# EAGLE design sr_controller_v1_revB (EAGLE 6.3)
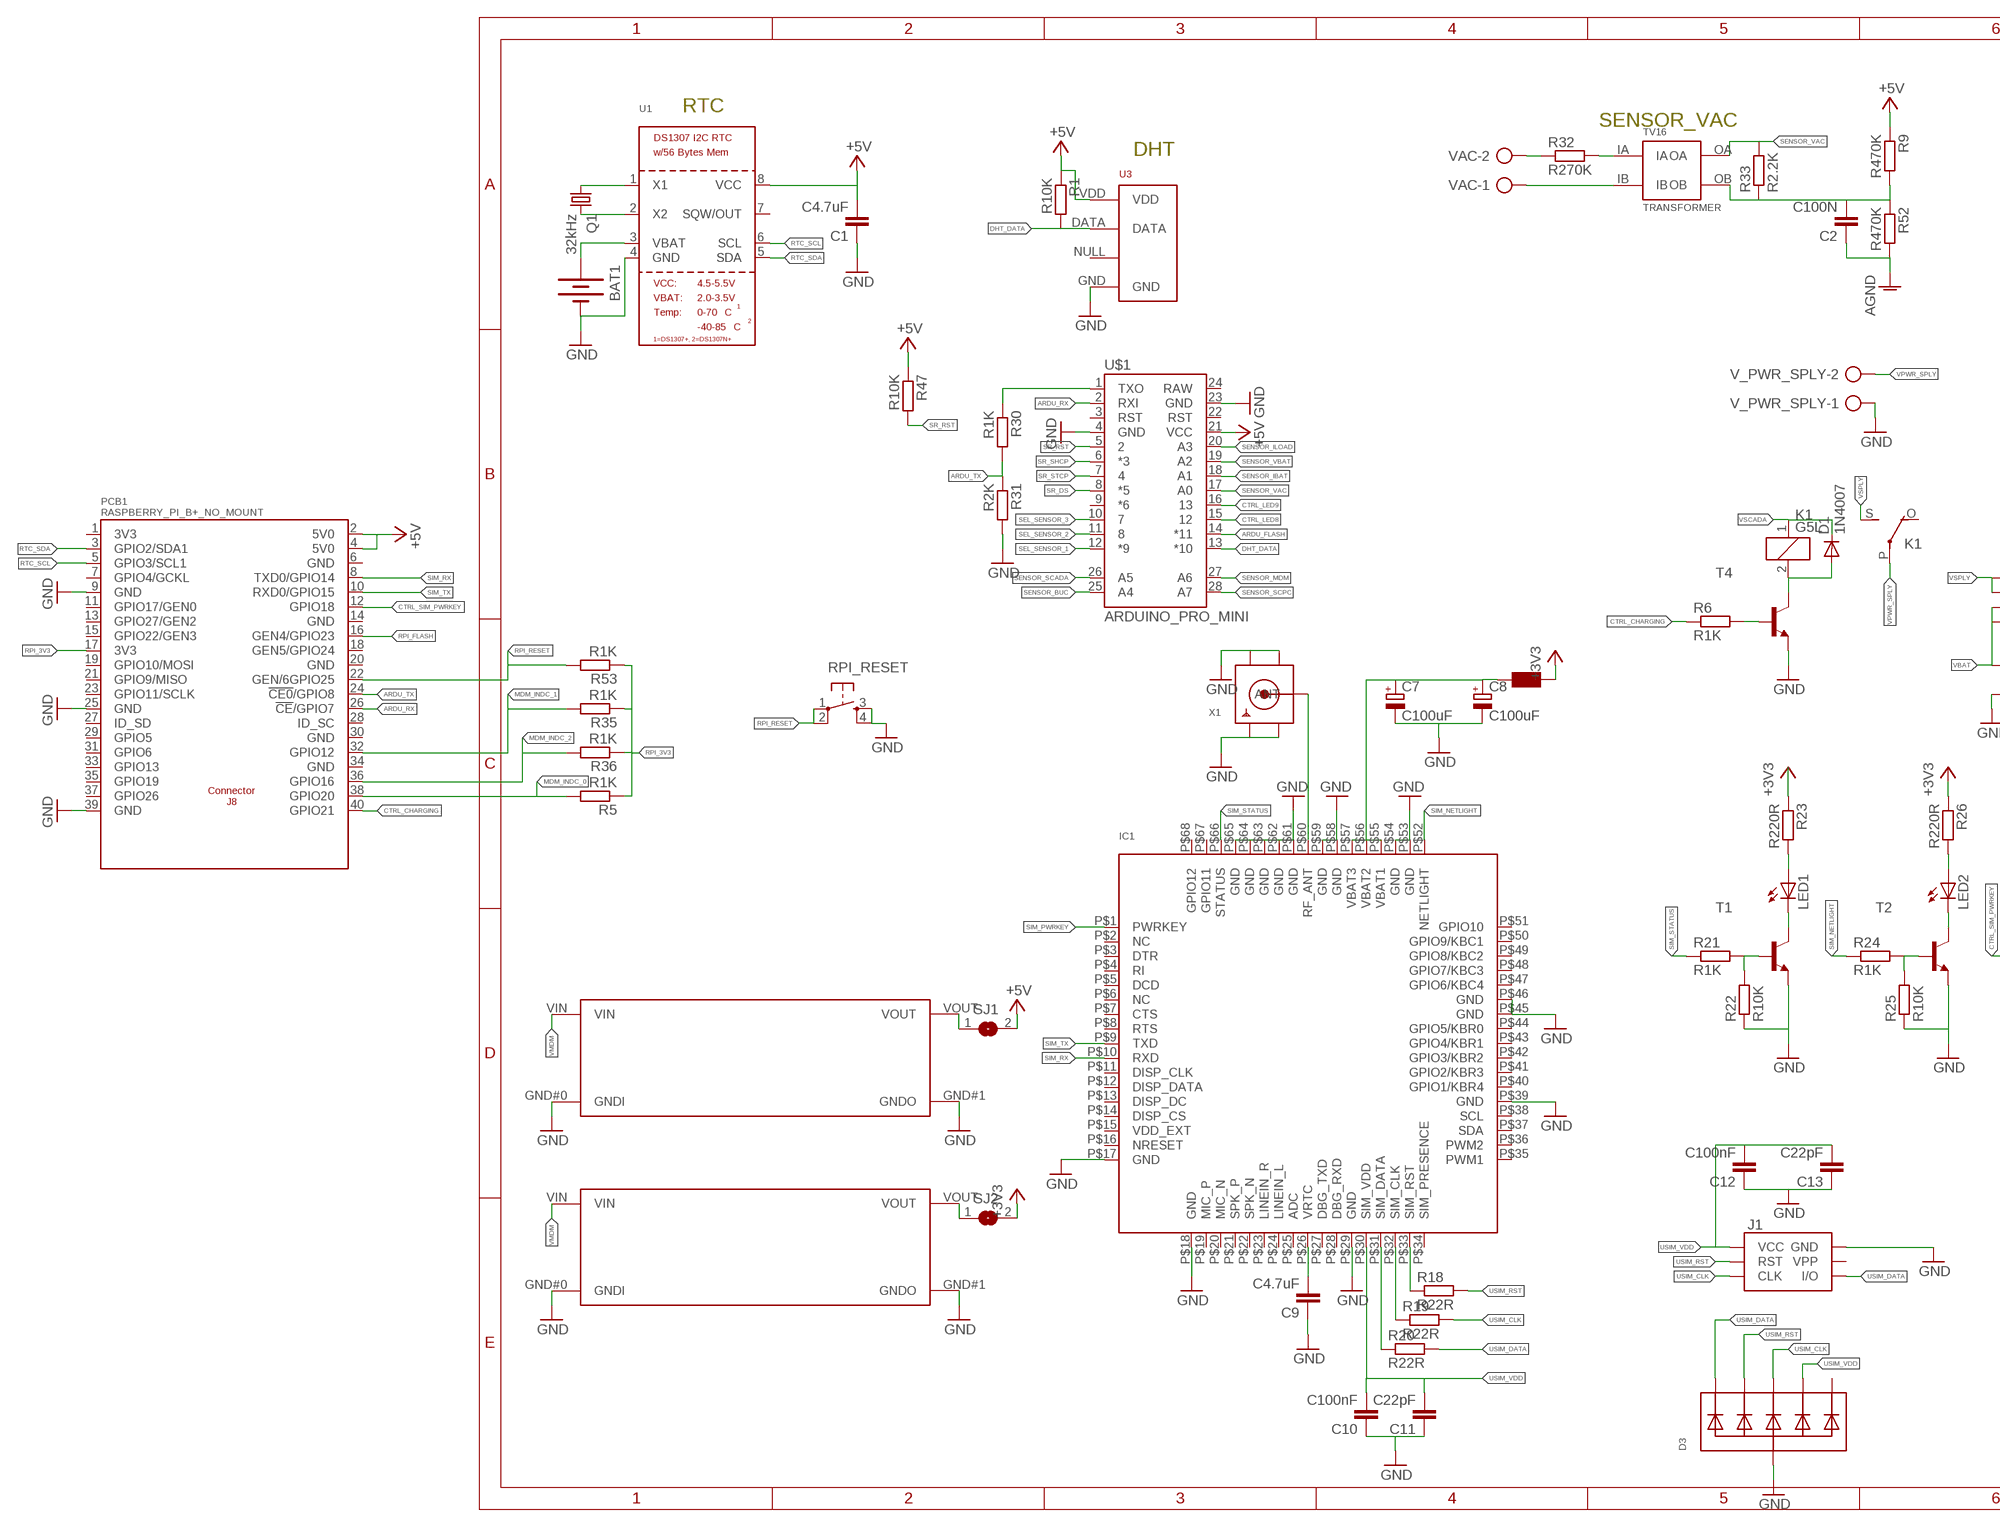
[diagram p0: schematic, sheet 1, part 1 of 2]
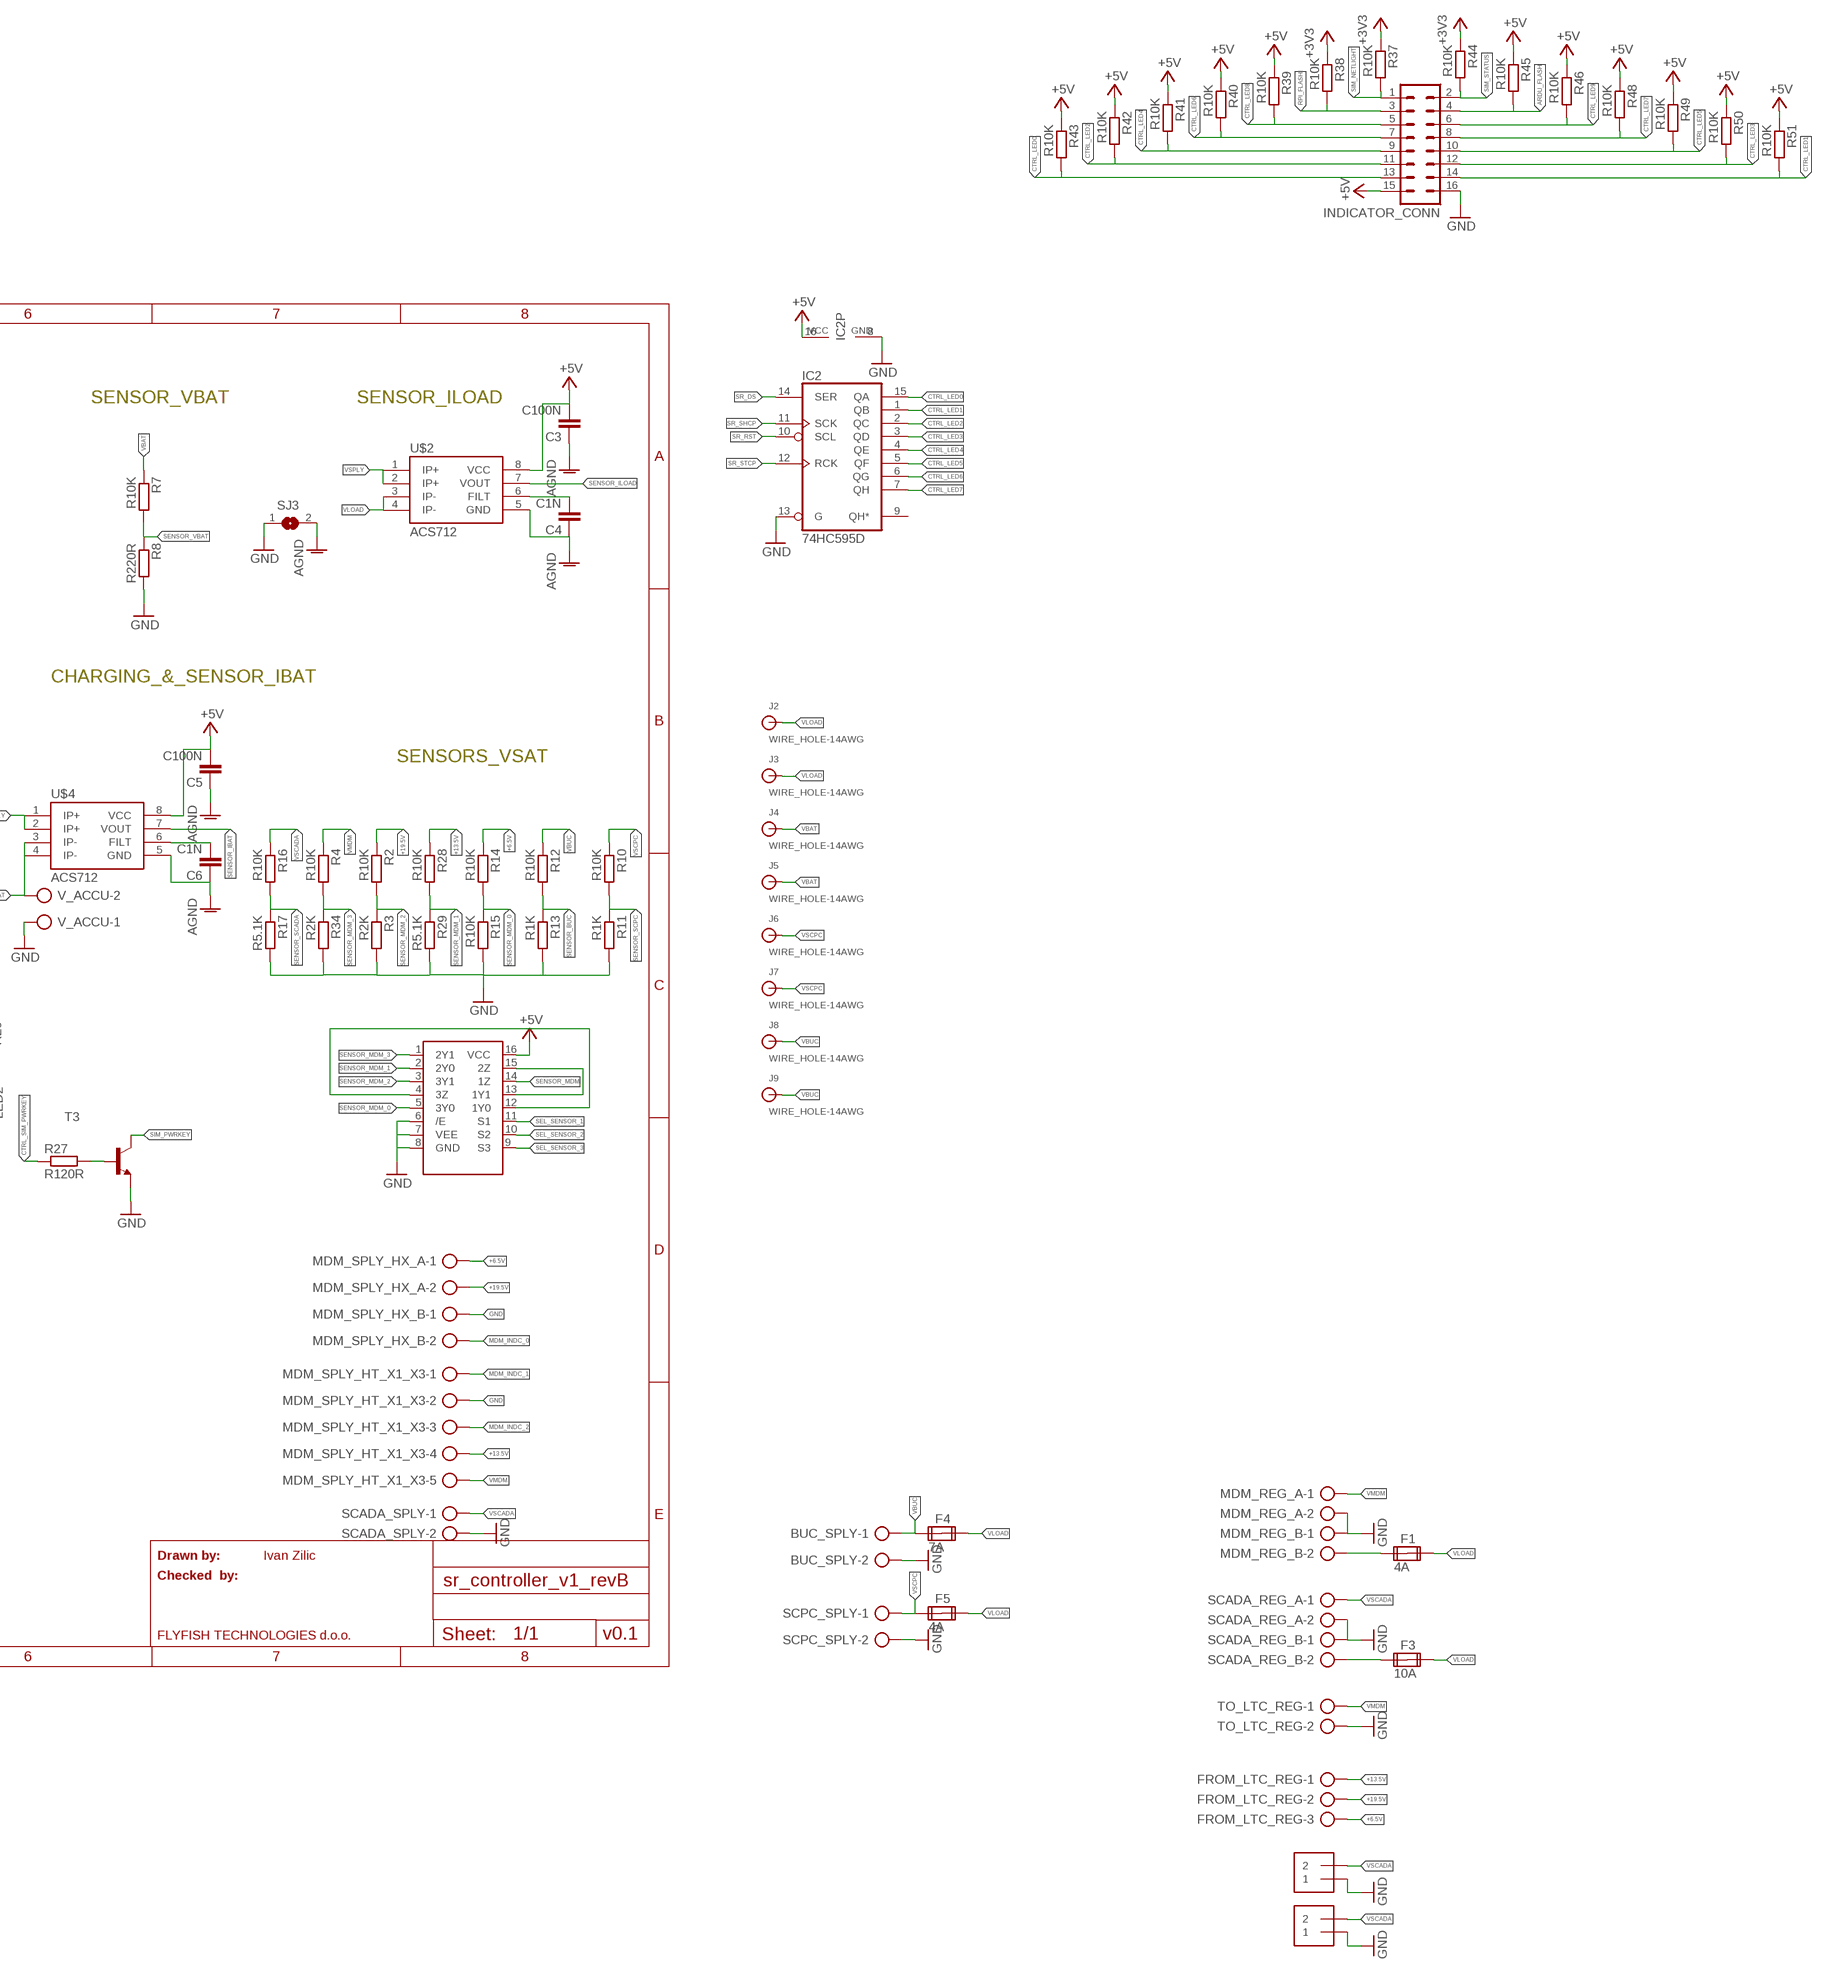
[diagram p1: schematic, sheet 1, part 2 of 2]

## Parts
BAT1  BATTERY20PTH  [BATTCOM_20MM_PTH]
BUC_SPLY  AK300/2  [AK300/2]
C1  C4.7uF  C-EUC0805  [C0805]
C2  C100N  C-EUC0805K  [C0805K]
C3  C100N  C-EUC0805K  [C0805K]
C4  C1N  C-EUC0805K  [C0805K]
C5  C100N  C-EUC0805K  [C0805K]
C6  C1N  C-EUC0805K  [C0805K]
C7  C100uF  CPOL-EU153CLV-0605  [153CLV-0605]
C8  C100uF  CPOL-EU153CLV-0605  [153CLV-0605]
C9  C4.7uF  C-EUC0805  [C0805]
C10  C100nF  C-EUC0805  [C0805]
C11  C22pF  C-EUC0805  [C0805]
C12  C100nF  C-EUC0805  [C0805]
C13  C22pF  C-EUC0805  [C0805]
D1  1N4007  DIODE-DO214AA  [DO214AA]
D3  TVSARRAY_5LANE  [SOT363]
F1  4A  FUSE2P  [FUSE1]
F3  10A  FUSE2P  [FUSE1]
F4  7A  FUSE2P  [FUSE1]
F5  4A  FUSE2P  [FUSE1]
FAN_A  1X2-3.5MM  [1X2-3.5MM]
FAN_B  1X2-3.5MM  [1X2-3.5MM]
FROM_LTC_REG  AK300/3  [AK300/3]
IC1  GSM_SIM900_LITERAL  [SIM900_SMT]
IC2  74HC595D  [SO16]
INDICATOR_CONN  MA08-2  [MA08-2]
J1  SIMHOLDERSIM  [SIMHOLDER]
J2  WIRE_HOLE-14AWG  [WIRE_HOLE-14AWG]
J3  WIRE_HOLE-14AWG  [WIRE_HOLE-14AWG]
J4  WIRE_HOLE-14AWG  [WIRE_HOLE-14AWG]
J5  WIRE_HOLE-14AWG  [WIRE_HOLE-14AWG]
J6  WIRE_HOLE-14AWG  [WIRE_HOLE-14AWG]
J7  WIRE_HOLE-14AWG  [WIRE_HOLE-14AWG]
J8  WIRE_HOLE-14AWG  [WIRE_HOLE-14AWG]
J9  WIRE_HOLE-14AWG  [WIRE_HOLE-14AWG]
K1  G5L  [G5LE]
L1  FB0603  L0603  [L0603]
LED1  LEDCHIPLED_0805  [CHIPLED_0805]
LED2  LEDCHIPLED_0805  [CHIPLED_0805]
MDM_REG_A  AK300/2  [AK300/2]
MDM_REG_B  AK300/2  [AK300/2]
MDM_SPLY_HT_X1_X3  AK300/5  [AK300/5]
MDM_SPLY_HX_A  AK500/2  [AK500/2]
MDM_SPLY_HX_B  AK500/2  [AK500/2]
PCB1  RASPBERRY_PI_B+_NO_MOUNT  [RASPBERRY_PI_B+]
Q1  32kHz  CRYSTALTC38H  [TC38H]
R1  R10K  R-EU_R0805  [R0805]
R2  R10K  R-EU_R0805  [R0805]
R3  R2K  R-EU_R0805  [R0805]
R4  R10K  R-EU_R0805  [R0805]
R5  R1K  R-EU_R0805  [R0805]
R6  R1K  R-EU_R0805  [R0805]
R7  R10K  R-EU_R0805  [R0805]
R8  R220R  R-EU_R0805  [R0805]
R9  R470K  R-EU_R0805  [R0805]
R10  R10K  R-EU_R0805  [R0805]
R11  R1K  R-EU_R0805  [R0805]
R12  R10K  R-EU_R0805  [R0805]
R13  R1K  R-EU_R0805  [R0805]
R14  R10K  R-EU_R0805  [R0805]
R15  R10K  R-EU_R0805  [R0805]
R16  R10K  R-EU_R0805  [R0805]
R17  R5.1K  R-EU_R0805  [R0805]
R18  R22R  R-EU_R0805  [R0805]
R19  R22R  R-EU_R0805  [R0805]
R20  R22R  R-EU_R0805  [R0805]
R21  R1K  R-EU_R0805  [R0805]
R22  R10K  R-EU_R0805  [R0805]
R23  R220R  R-EU_R0805  [R0805]
R24  R1K  R-EU_R0805  [R0805]
R25  R10K  R-EU_R0805  [R0805]
R26  R220R  R-EU_R0805  [R0805]
R27  R120R  R-EU_R0805  [R0805]
R28  R10K  R-EU_R0805  [R0805]
R29  R5.1K  R-EU_R0805  [R0805]
R30  R1K  R-EU_R0805  [R0805]
R31  R2K  R-EU_R0805  [R0805]
R32  R270K  R-EU_0309/10  [0309/10]
R33  R2.2K  R-EU_0309/10  [0309/10]
R34  R2K  R-EU_R0805  [R0805]
R35  R1K  R-EU_R0805  [R0805]
R36  R1K  R-EU_R0805  [R0805]
R37  R10K  R-EU_R0805  [R0805]
R38  R10K  R-EU_R0805  [R0805]
R39  R10K  R-EU_R0805  [R0805]
R40  R10K  R-EU_R0805  [R0805]
R41  R10K  R-EU_R0805  [R0805]
R42  R10K  R-EU_R0805  [R0805]
R43  R10K  R-EU_R0805  [R0805]
R44  R10K  R-EU_R0805  [R0805]
R45  R10K  R-EU_R0805  [R0805]
R46  R10K  R-EU_R0805  [R0805]
R47  R10K  R-EU_R0805  [R0805]
R48  R10K  R-EU_R0805  [R0805]
R49  R10K  R-EU_R0805  [R0805]
R50  R10K  R-EU_R0805  [R0805]
R51  R10K  R-EU_R0805  [R0805]
R52  R470K  R-EU_R0805  [R0805]
R53  R1K  R-EU_R0805  [R0805]
RPI_RESET  TAC_SWITCHPTH  [TACTILE-PTH]
SCADA_REG_A  AK300/2  [AK300/2]
SCADA_REG_B  AK300/2  [AK300/2]
SCADA_SPLY  AK500/2  [AK500/2]
SCPC_SPLY  AK300/2  [AK300/2]
SJ1  SOLDERJUMPER  [SOLDERJUMPER_ARROW_NOPASTE]
SJ2  SOLDERJUMPER  [SOLDERJUMPER_ARROW_NOPASTE]
SJ3  SOLDERJUMPERCLOSED  [SOLDERJUMPER_CLOSEDWIRE]
T1  MMBT2222ALT1-NPN-SOT23-BEC  [SOT23-BEC]
T2  MMBT2222ALT1-NPN-SOT23-BEC  [SOT23-BEC]
T3  MMBT2222ALT1-NPN-SOT23-BEC  [SOT23-BEC]
T4  MMBT2222ALT1-NPN-SOT23-BEC  [SOT23-BEC]
TO_LTC_REG  AK300/2  [AK300/2]
TV16  TRANSFORMER  [TV16]
U1  RTC_DS1307  [SOIC8_150MIL]
U3  RHT03_DHT-22_AM2302  [RHT03_DHT-22]
U$1  ARDUINO_PRO_MINI  [ARDUINO_PRO_MINI]
U$2  ACS712  [SO08]
U$3  DCDCMODULE  [DCDCMODULE]
U$4  ACS712  [SO08]
U$6  DCDCMODULE  [DCDCMODULE]
U$8  74HC4053D  [SO16]
V_ACCU  AK300/2  [AK300/2]
V_PWR_SPLY  AK300/2  [AK300/2]
VAC  AK300/2  [AK300/2]
X1  SMACONNECTOR  [SMA90_DIP]

## Nets
+3V3: L1.2 R23.1 R26.1 R37.1 R38.1 R44.1 SJ2.2
+5V: C1.2 C3.2 C5.2 IC2.16(VCC) INDICATOR_CONN.15 PCB1.2(5V0) PCB1.4(5V0) R1.1 R9.1 R39.1 R40.1 R41.1 R42.1 R43.1 R45.1 R46.1 R47.1 R48.1 R49.1 R50.1 R51.1 SJ1.2 U1.8(VCC) U3.VDD U$1.21(VCC) U$2.8(VCC) U$4.8(VCC) U$8.16(VCC)
+6.5V: FROM_LTC_REG.3 MDM_SPLY_HX_A.1 R14.1
+13.5V: FROM_LTC_REG.1 MDM_SPLY_HT_X1_X3.4 R28.1
+19.5V: FROM_LTC_REG.2 MDM_SPLY_HX_A.2 R2.1
AGND: C2.1 C3.1 C4.1 C5.1 C6.1 R52.2 SJ3.2 U$2.5(GND) U$4.5(GND)
ARDU_FLASH: INDICATOR_CONN.4 R45.2 U$1.14(*11)
ARDU_RX: PCB1.26(!CE!/GPIO7) U$1.2(RXI)
ARDU_TX: PCB1.24(!CE0!/GPIO8) R30.2 R31.1
CTRL_CHARGING: PCB1.40(GPIO21) R6.1
CTRL_LED0: IC2.15(QA) INDICATOR_CONN.13 R43.2
CTRL_LED1: IC2.1(QB) INDICATOR_CONN.14 R51.2
CTRL_LED2: IC2.2(QC) INDICATOR_CONN.11 R42.2
CTRL_LED3: IC2.3(QD) INDICATOR_CONN.12 R50.2
CTRL_LED4: IC2.4(QE) INDICATOR_CONN.9 R41.2
CTRL_LED5: IC2.5(QF) INDICATOR_CONN.10 R49.2
CTRL_LED6: IC2.6(QG) INDICATOR_CONN.7 R40.2
CTRL_LED7: IC2.7(QH) INDICATOR_CONN.8 R48.2
CTRL_LED8: INDICATOR_CONN.5 R39.2 U$1.15
CTRL_LED9: INDICATOR_CONN.6 R46.2 U$1.16
CTRL_SIM_PWRKEY: PCB1.12(GPIO18) R27.1
DHT_DATA: R1.2 U3.DATA U$1.13(*10)
GND: BAT1.2(-) BUC_SPLY.2 C1.1 C7.- C8.- C9.1 C10.1 C11.1 C12.1 C13.1 D3.2(A) FAN_A.1 FAN_B.1 IC1.P$17(GND) IC1.P$18(GND) IC1.P$29(GND) IC1.P$39(GND) IC1.P$45(GND) IC1.P$46(GND) IC1.P$53(GND) IC1.P$54(GND) IC1.P$58(GND) IC1.P$59(GND) IC1.P$61(GND) IC1.P$62(GND) IC1.P$63(GND) IC1.P$64(GND) IC1.P$65(GND) IC2.8(GND) IC2.13(G) INDICATOR_CONN.16 J1.C5(GND) MDM_REG_A.2 MDM_REG_B.1 MDM_SPLY_HT_X1_X3.2 MDM_SPLY_HX_B.1 PCB1.9(GND) PCB1.25(GND) PCB1.39(GND) R3.2 R8.2 R11.2 R13.2 R15.2 R17.2 R22.1 R25.1 R29.2 R31.2 R34.2 RPI_RESET.3 RPI_RESET.4 SCADA_REG_A.2 SCADA_REG_B.1 SCADA_SPLY.2 SCPC_SPLY.2 SJ3.1 T1.E T2.E T3.E T4.E TO_LTC_REG.2 U1.4(GND) U3.GND U$1.4(GND) U$1.23(GND) U$3.GND#0(GNDI) U$3.GND#1(GNDO) U$6.GND#0(GNDI) U$6.GND#1(GNDO) U$8.6(/E) U$8.7(VEE) U$8.8(GND) V_ACCU.1 V_PWR_SPLY.1 X1.GND1 X1.GND2 X1.GND3 X1.GND4
MDM_INDC_0: MDM_SPLY_HX_B.2 PCB1.38(GPIO20) R5.2
MDM_INDC_1: MDM_SPLY_HT_X1_X3.1 PCB1.32(GPIO12) R35.2
MDM_INDC_2: MDM_SPLY_HT_X1_X3.3 PCB1.36(GPIO16) R36.2
N$1: R32.1 VAC.2
N$2: TV16.IB VAC.1
N$3: Q1.1 U1.1(X1)
N$4: Q1.2 U1.2(X2)
N$5: BAT1.1(+) U1.3(VBAT)
N$6: U$8.13(1Y1) U$8.15(2Z)
N$7: U$8.4(3Z) U$8.12(1Y0)
N$8: SJ1.1 U$3.VOUT
N$9: SJ2.1 U$6.VOUT
N$10: C4.2 U$2.6(FILT)
N$13: R6.2 T4.B
N$16: C6.2 U$4.6(FILT)
N$17: F1.1A MDM_REG_B.2
N$19: F3.1A SCADA_REG_B.2
N$21: IC1.P$60(RF_ANT) X1.ANTENNA(ANT)
N$22: C7.+ C8.+ IC1.P$55(VBAT1) IC1.P$56(VBAT2) IC1.P$57(VBAT3) L1.1
N$23: C9.2 IC1.P$26(VRTC)
N$24: IC1.P$33(SIM_RST) R18.1
N$25: IC1.P$32(SIM_CLK) R19.1
N$26: IC1.P$31(SIM_DATA) R20.1
N$27: LED1.C T1.C
N$28: LED1.A R23.2
N$29: LED2.C T2.C
N$30: R21.2 R22.2 T1.B
N$31: LED2.A R26.2
N$32: R24.2 R25.2 T2.B
N$33: R27.2 T3.B
N$34: D1.A K1.2 T4.C
N$35: R30.1 U$1.1(TXO)
N$36: R32.2 TV16.IA
N$38: C2.2 R9.2 R33.1 R52.1 TV16.OB
RPI_3V3: PCB1.17(3V3) R5.1 R35.1 R36.1 R53.1
RPI_FLASH: INDICATOR_CONN.3 PCB1.16(GEN4/GPIO23) R38.2
RPI_RESET: PCB1.22(GEN/6GPIO25) R53.2 RPI_RESET.1 RPI_RESET.2
RTC_SCL: PCB1.5(GPIO3/SCL1) U1.6(SCL)
RTC_SDA: PCB1.3(GPIO2/SDA1) U1.5(SDA)
SEL_SENSOR_1: U$1.12(*9) U$8.11(S1)
SEL_SENSOR_2: U$1.11 U$8.10(S2)
SEL_SENSOR_3: U$1.10 U$8.9(S3)
SENSOR_BUC: R12.2 R13.1 U$1.25(A4)
SENSOR_IBAT: U$1.18(A1) U$4.7(VOUT)
SENSOR_ILOAD: U$1.20(A3) U$2.7(VOUT)
SENSOR_MDM: U$1.27(A6) U$8.14(1Z)
SENSOR_MDM_0: R14.2 R15.1 U$8.5(3Y0)
SENSOR_MDM_1: R28.2 R29.1 U$8.2(2Y0)
SENSOR_MDM_2: R2.2 R3.1 U$8.3(3Y1)
SENSOR_MDM_3: R4.2 R34.1 U$8.1(2Y1)
SENSOR_SCADA: R16.2 R17.1 U$1.26(A5)
SENSOR_SCPC: R10.2 R11.1 U$1.28(A7)
SENSOR_VAC: R33.2 TV16.OA U$1.17(A0)
SENSOR_VBAT: R7.2 R8.1 U$1.19(A2)
SIM_NETLIGHT: IC1.P$52(NETLIGHT) INDICATOR_CONN.1 R24.1 R37.2
SIM_PWRKEY: IC1.P$1(PWRKEY) T3.C
SIM_RX: IC1.P$10(RXD) PCB1.8(TXD0/GPIO14)
SIM_STATUS: IC1.P$66(STATUS) INDICATOR_CONN.2 R21.1 R44.2
SIM_TX: IC1.P$9(TXD) PCB1.10(RXD0/GPIO15)
SR_DS: IC2.14(SER) U$1.8(*5)
SR_RST: IC2.10(SCL) R47.2 U$1.5
SR_SHCP: IC2.11(SCK) U$1.6(*3)
SR_STCP: IC2.12(RCK) U$1.7
USIM_CLK: D3.4(C3) J1.C3(CLK) R19.2
USIM_DATA: D3.1(C1) J1.C7(I/O) R20.2
USIM_RST: D3.3(C2) J1.C2(RST) R18.2
USIM_VDD: C10.2 C11.2 C12.2 C13.2 D3.5(C4) IC1.P$30(SIM_VDD) J1.C1(VCC)
VBAT: J4.P$1 J5.P$1 R7.1 U$4.3(IP-) U$4.4(IP-) V_ACCU.2
VBUC: BUC_SPLY.1 F4.1A J8.P$1 J9.P$1 R12.1
VLOAD: F1.2A F3.2A F4.2A F5.2A J2.P$1 J3.P$1 U$2.3(IP-) U$2.4(IP-)
VMDM: MDM_REG_A.1 MDM_SPLY_HT_X1_X3.5 R4.1 TO_LTC_REG.1 U$3.VIN U$6.VIN
VPWR_SPLY: K1.P(2:P) V_PWR_SPLY.2
VSCADA: D1.C FAN_A.2 FAN_B.2 K1.1 R16.1 SCADA_REG_A.1 SCADA_SPLY.1
VSCPC: F5.1A J6.P$1 J7.P$1 R10.1 SCPC_SPLY.1
VSPLY: K1.S(2:S) U$2.1(IP+) U$2.2(IP+) U$4.1(IP+) U$4.2(IP+)
Unconnected: D3.6(C5) F1.1B F1.2B F3.1B F3.2B F4.1B F4.2B F5.1B F5.2B IC1.P$2(NC) IC1.P$3(DTR) IC1.P$4(RI) IC1.P$5(DCD) IC1.P$6(NC) IC1.P$7(CTS) IC1.P$8(RTS) IC1.P$11(DISP_CLK) IC1.P$12(DISP_DATA) IC1.P$13(DISP_DC) IC1.P$14(DISP_CS) IC1.P$15(VDD_EXT) IC1.P$16(NRESET) IC1.P$19(MIC_P) IC1.P$20(MIC_N) IC1.P$21(SPK_P) IC1.P$22(SPK_N) IC1.P$23(LINEIN_R) IC1.P$24(LINEIN_L) IC1.P$25(ADC) IC1.P$27(DBG_TXD) IC1.P$28(DBG_RXD) IC1.P$34(SIM_PRESENCE) IC1.P$35(PWM1) IC1.P$36(PWM2) IC1.P$37(SDA) IC1.P$38(SCL) IC1.P$40(GPIO1/KBR4) IC1.P$41(GPIO2/KBR3) IC1.P$42(GPIO3/KBR2) IC1.P$43(GPIO4/KBR1) IC1.P$44(GPIO5/KBR0) IC1.P$47(GPIO6/KBC4) IC1.P$48(GPIO7/KBC3) IC1.P$49(GPIO8/KBC2) IC1.P$50(GPIO9/KBC1) IC1.P$51(GPIO10) IC2.9(QH*) J1.C6(VPP) K1.O(2:O) PCB1.1(3V3) PCB1.6(GND) PCB1.7(GPIO4/GCKL) PCB1.11(GPIO17/GEN0) PCB1.13(GPIO27/GEN2) PCB1.14(GND) PCB1.15(GPIO22/GEN3) PCB1.18(GEN5/GPIO24) PCB1.19(GPIO10/MOSI) PCB1.20(GND) PCB1.21(GPIO9/MISO) PCB1.23(GPIO11/SCLK) PCB1.27(ID_SD) PCB1.28(ID_SC) PCB1.29(GPIO5) PCB1.30(GND) PCB1.31(GPIO6) PCB1.33(GPIO13) PCB1.34(GND) PCB1.35(GPIO19) PCB1.37(GPIO26) U1.7(SQW/OUT) U3.NULL U$1.3(RST) U$1.9(*6) U$1.22(RST) U$1.24(RAW)

## Notes on the sheet
- RTC
- SENSOR_VAC | SENSOR_VBAT | SENSOR_ILOAD
- DHT
- CHARGING_&_SENSOR_IBAT
- SENSORS_VSAT
- Drawn by: | Ivan Zilic
- Checked  by:
- FLYFISH TECHNOLOGIES d.o.o. | v0.1

## Power pins joined to a net without a drawn wire
GPIO11: IC1.P$67(GPIO11)
GPIO12: IC1.P$68(GPIO12)

## Library data of the parts
BAT1 = SparkFun-Electromechanical:BATTERY: Battery Holders Various common sizes : AA, AAA, 20mm coin cell and 12mm coin cell. 20MM_4LEGS, BATT-10373
BUC_SPLY MDM_REG_A MDM_REG_B SCADA_REG_A SCADA_REG_B SCPC_SPLY TO_LTC_REG V_ACCU V_PWR_SPLY VAC = con-ptr500:AK300/2: CONNECTOR; OC_FARNELL: unknown; OC_NEWARK: unknown
C1-C6 C9-C13 = resistor:C-EU: CAPACITOR, European symbol
C7 C8 = resistor:CPOL-EU: POLARIZED CAPACITOR, European symbol
D1 = diode:DIODE-: DIODE
D3 = microbuilder:TVSARRAY_5LANE: Voltage Transient Suppressor Array SOT363 SMF05C - 100W 5V: Digikey - SMF05CT1GOSCT-ND
F1 F3-F5 = special:FUSE2P: FUSE 5 x 20 mm
FAN_A FAN_B = adafruit:1X2: 3.5mm Terminal block http://www.ladyada.net/library/pcb/eaglelibrary.html
FROM_LTC_REG = con-ptr500:AK300/3: CONNECTOR; OC_FARNELL: unknown; OC_NEWARK: unknown
IC1 = microbuilder:GSM_SIM900_LITERAL: SIM900 Quad-Band GSM/GPRS Module Power Supply: 3.2-4.8V Temperature Range: -30�C-+80�C Bands: GSM 850, EGSM 900, DCS 1800, PCS 1900
IC2 = 74xx-eu:74*595: 8-bit SHIFT REGISTER, output latch
INDICATOR_CONN = con-lstb:MA08-2: PIN HEADER; OC_FARNELL: unknown; OC_NEWARK: unknown
J1 = SparkFun-Connectors:SIMHOLDER: SIM Socket Socket for SIM cellular cards. Schematic element and footprint production proven. Spark Fun Electronics SKU : PRT-00548; PROD_ID: CONN-08536
J2-J9 = powercube:WIRE_HOLE-14AWG: Solder point for 14AWG wire
K1 = relay:G5L: RELAY 1 x switch, 10 A/120 V AC, 8 A/30 V ADC, Omron; OC_FARNELL: unknown; OC_NEWARK: unknown
L1 = tigorcustom:L0603
LED1 LED2 = adafruit:LED: LED OSRAM: - CHIPLED LG R971, LG N971, LY N971, LG Q971, LY Q971, LO R971, LY R971 LH N974, LH R974 LS Q976, LO Q976, LY Q976 LO Q996 - Hyper CHIPLED LW Q18S LB Q993, LB Q99A, LB R99A - SideLED LS A670, LO A670, LY A670, LG A670, LP A670 LB A673, LV A673, LT A673, LW A673 LH A674 LY A675 LS A676, LA A676, LO A676, LY A676, LW A676 LS A679, LY A679, LG A679 - Hyper Micro SIDELED® LS Y876, LA Y876, LO Y876, LY Y876 LT Y87S - SmartLED LW L88C, LW L88S LB L89C, LB L89S, LG L890 LS L89K, LO L89K, LY L89K LS L896, LA L896, LO L896, LY L896 - TOPLED LS T670, LO T670, LY T670, LG T670, LP T670 LSG T670, LSP T670, LSY T670, LOP T670, LYG T670 LG T671, LOG T671, LSG T671 LB T673, LV T673, LT T673, LW T673 LH T674 LS T676, LA T676, LO T676, LY T676, LB T676, LH T676, LSB T676, LW T676 LB T67C, LV T67C, LT T67C, LS T67K, LO T67K, LY T67K, LW E67C LS E67B, LA E67B, LO E67B, LY E67B, LB E67C, LV E67C, LT E67C LW T67C LS T679, LY T679, LG T679 LS T770, LO T770, LY T770, LG T770, LP T770 LB T773, LV T773, LT T773, LW T773 LH T774 LS E675, LA E675, LY E675, LS T675 LS T776, LA T776, LO T776, LY T776, LB T776 LHGB T686 LT T68C, LB T68C - Hyper Mini TOPLED® LB M676 - Mini TOPLED Santana® LG M470 LS M47K, LO M47K, LY M47K Source: http://www.osram.convergy.de/
MDM_SPLY_HT_X1_X3 = con-ptr500:AK300/5: CONNECTOR; OC_FARNELL: unknown; OC_NEWARK: unknown
MDM_SPLY_HX_A MDM_SPLY_HX_B SCADA_SPLY = con-ptr500:AK500/2: CONNECTOR; OC_FARNELL: unknown; OC_NEWARK: unknown
PCB1 = tigorcustom:RASPBERRY_PI_B+_NO_MOUNT: Raspberry Pi B+ Based on issue: Thursday, July 10, 2014 - Rev 1.2 LBR by Tim R. 07-2014
Q1 = crystal:CRYSTAL: CRYSTAL; OC_FARNELL: unknown; OC_NEWARK: unknown
R1-R53 = resistor:R-EU_: RESISTOR, European symbol
RPI_RESET = SparkFun-Electromechanical:TAC_SWITCH: Momentary Switch Button commonly used for reset or general input. Spark Fun Electronics SKU : COM-00097 SMT- SWCH-08247
SJ1 SJ2 = microbuilder:SOLDERJUMPER: SMD Solder JUMPER Solder the two pads together to create a connection, or remove the solder to break it. REFLOW - Use this footprint for solder paste and reflow ovens. WAVE - Use this footprint for hand-soldering (larger pads). CLOSED - Has a trace between the two pads to ensure it is closed by default. The trace needs to be cut to disable the jumper, and can be closed again by creating a solder bridge between the two pads.; BOM: EXCLUDE
SJ3 = microbuilder:SOLDERJUMPER: SMD Solder JUMPER Solder the two pads together to create a connection, or remove the solder to break it. REFLOW - Use this footprint for solder paste and reflow ovens. WAVE - Use this footprint for hand-soldering (larger pads). CLOSED - Has a trace between the two pads to ensure it is closed by default. The trace needs to be cut to disable the jumper, and can be closed again by creating a solder bridge between the two pads.
T1-T4 = transistor:*-NPN-: NPN Transistror BF959 corrected 2008.03.06
TV16 = bontor:TRANSFORMER
U1 = microbuilder:RTC_DS1307: DS1307 I2C RTC with 56-Bytes RAM
U3 = RHT03_DHT-22_AM2302:RHT03_DHT-22_AM2302: RHT03 / DHT-22 / AM2302 Packages and symbol for the RHT03 / DHT-22 relative humidity and temperature sensor. Note: The AM2302 is a wired version of the DHT-22 which typically requires less clearance and is thus provided as a separate package.; PROD_ID: SEN-10167
U$1 = tigorcustom:ARDUINO_PRO_MINI
U$2 U$4 = SparkFun-AnalogIC:ACS712: Hall-effect-based isolated linear current sensor
U$3 U$6 = bontor:DCDCMODULE
U$8 = tigorcustom:74HC4053D
X1 = microbuilder:SMACONNECTOR: SMA Connector 90� DIP SMA Connector, 50 Ohm (4UConnector: 07259)

## Board
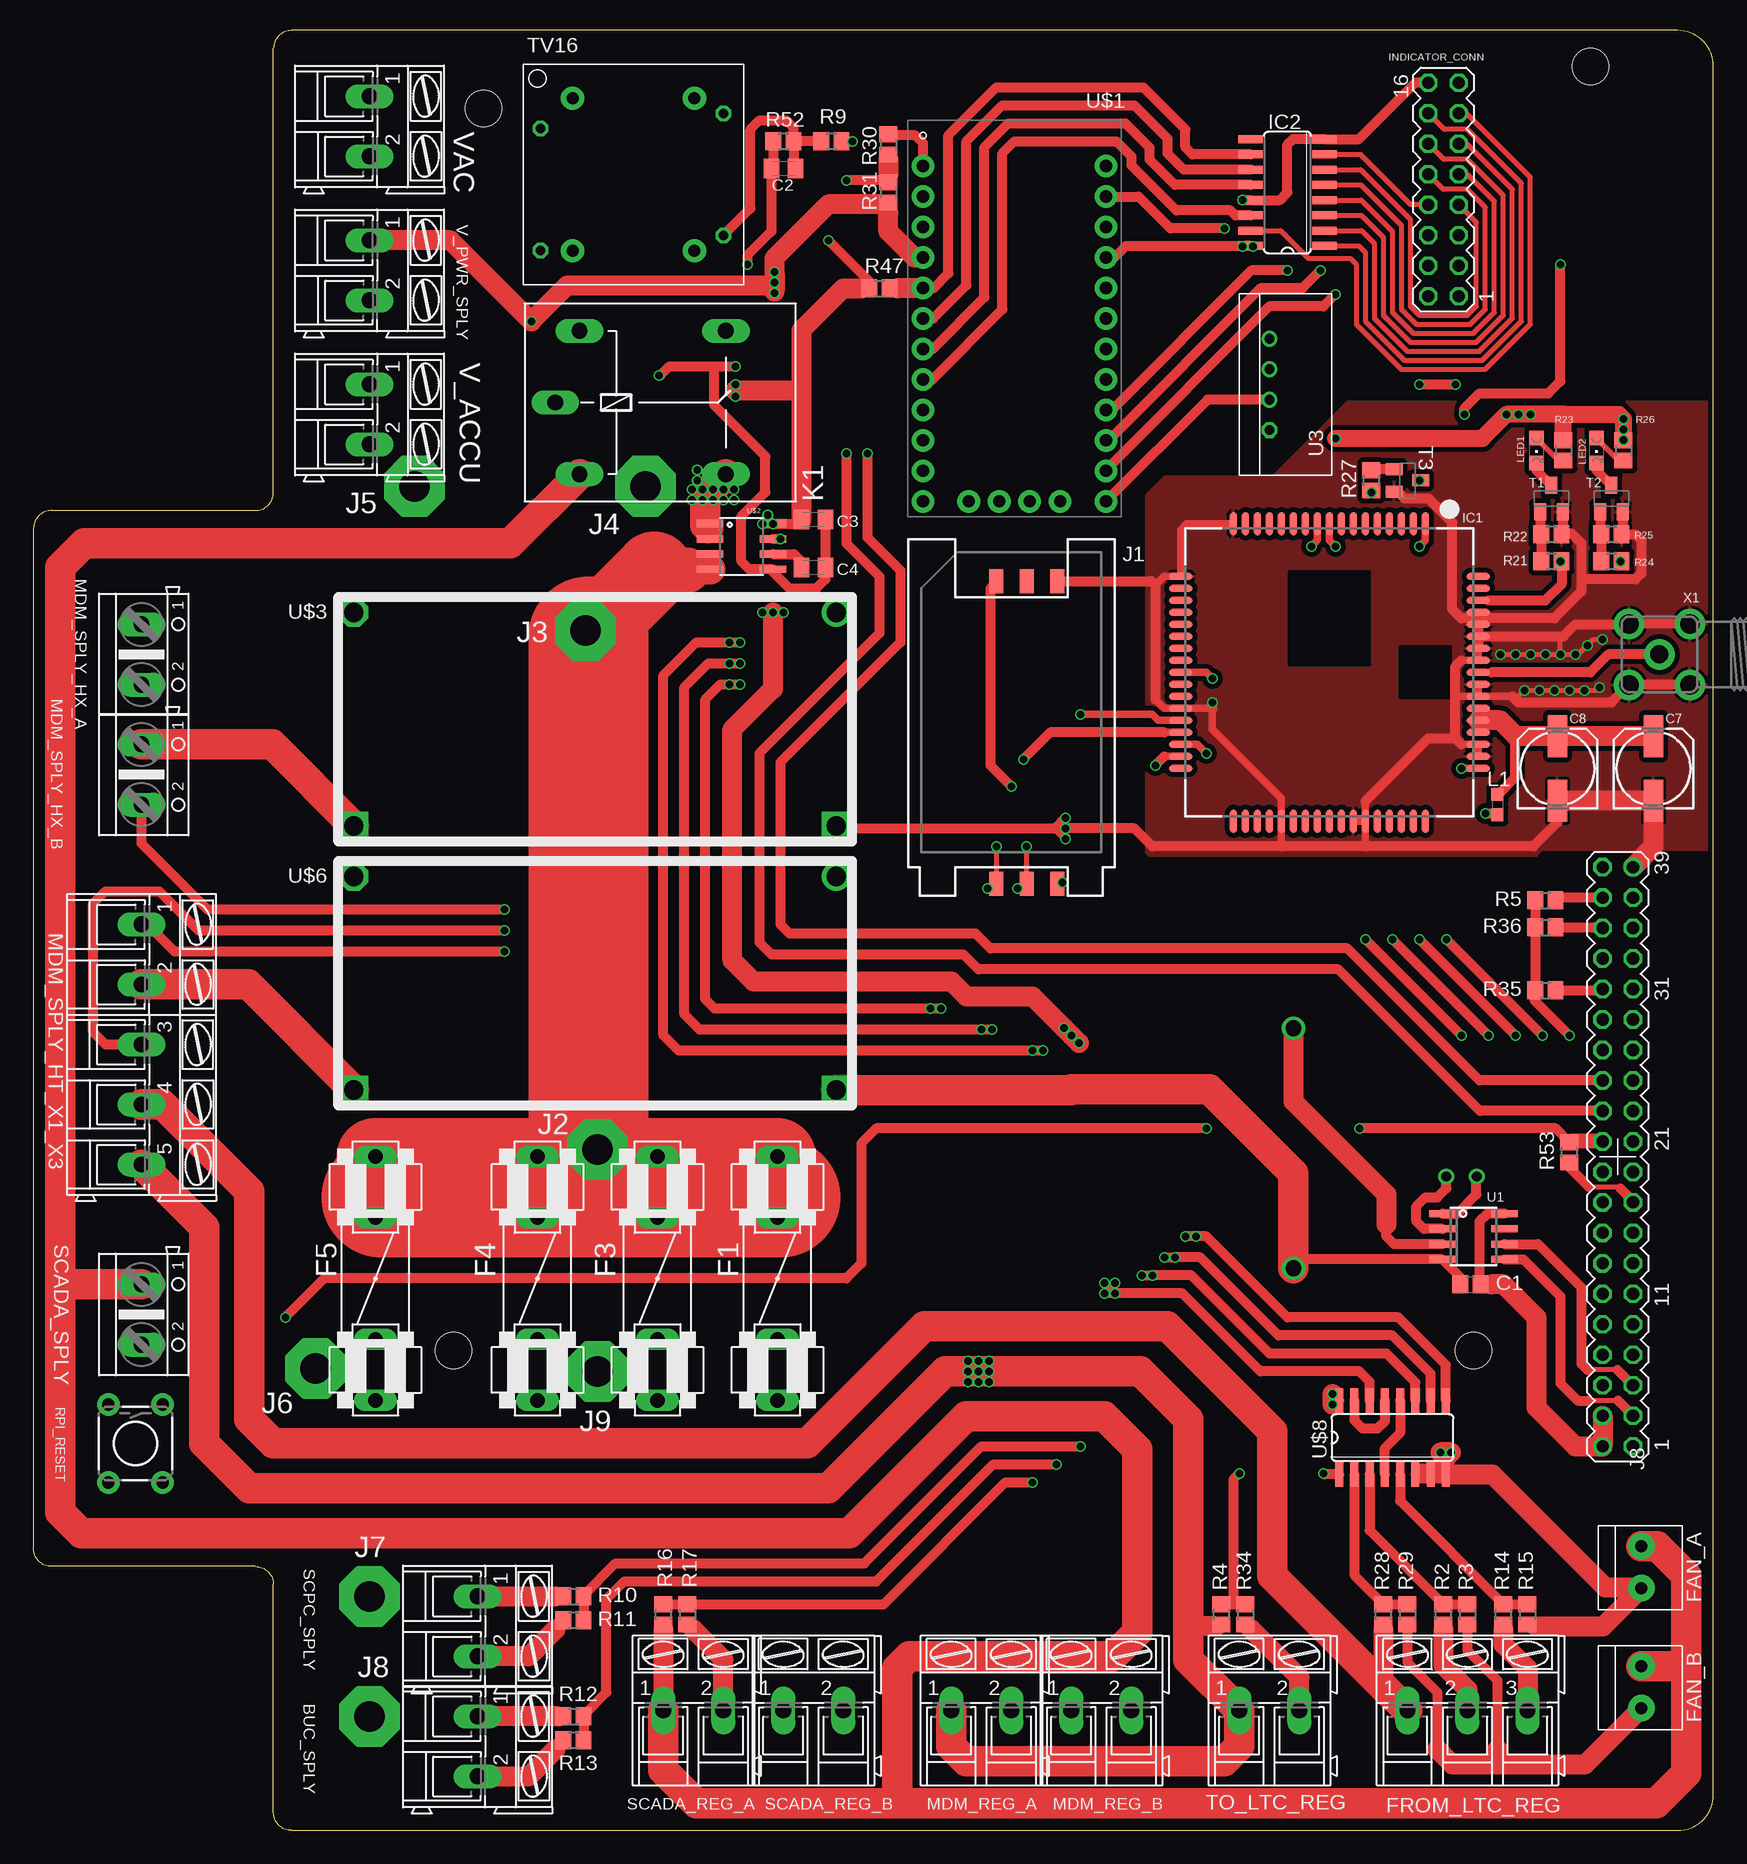
[diagram p2: board, top side]
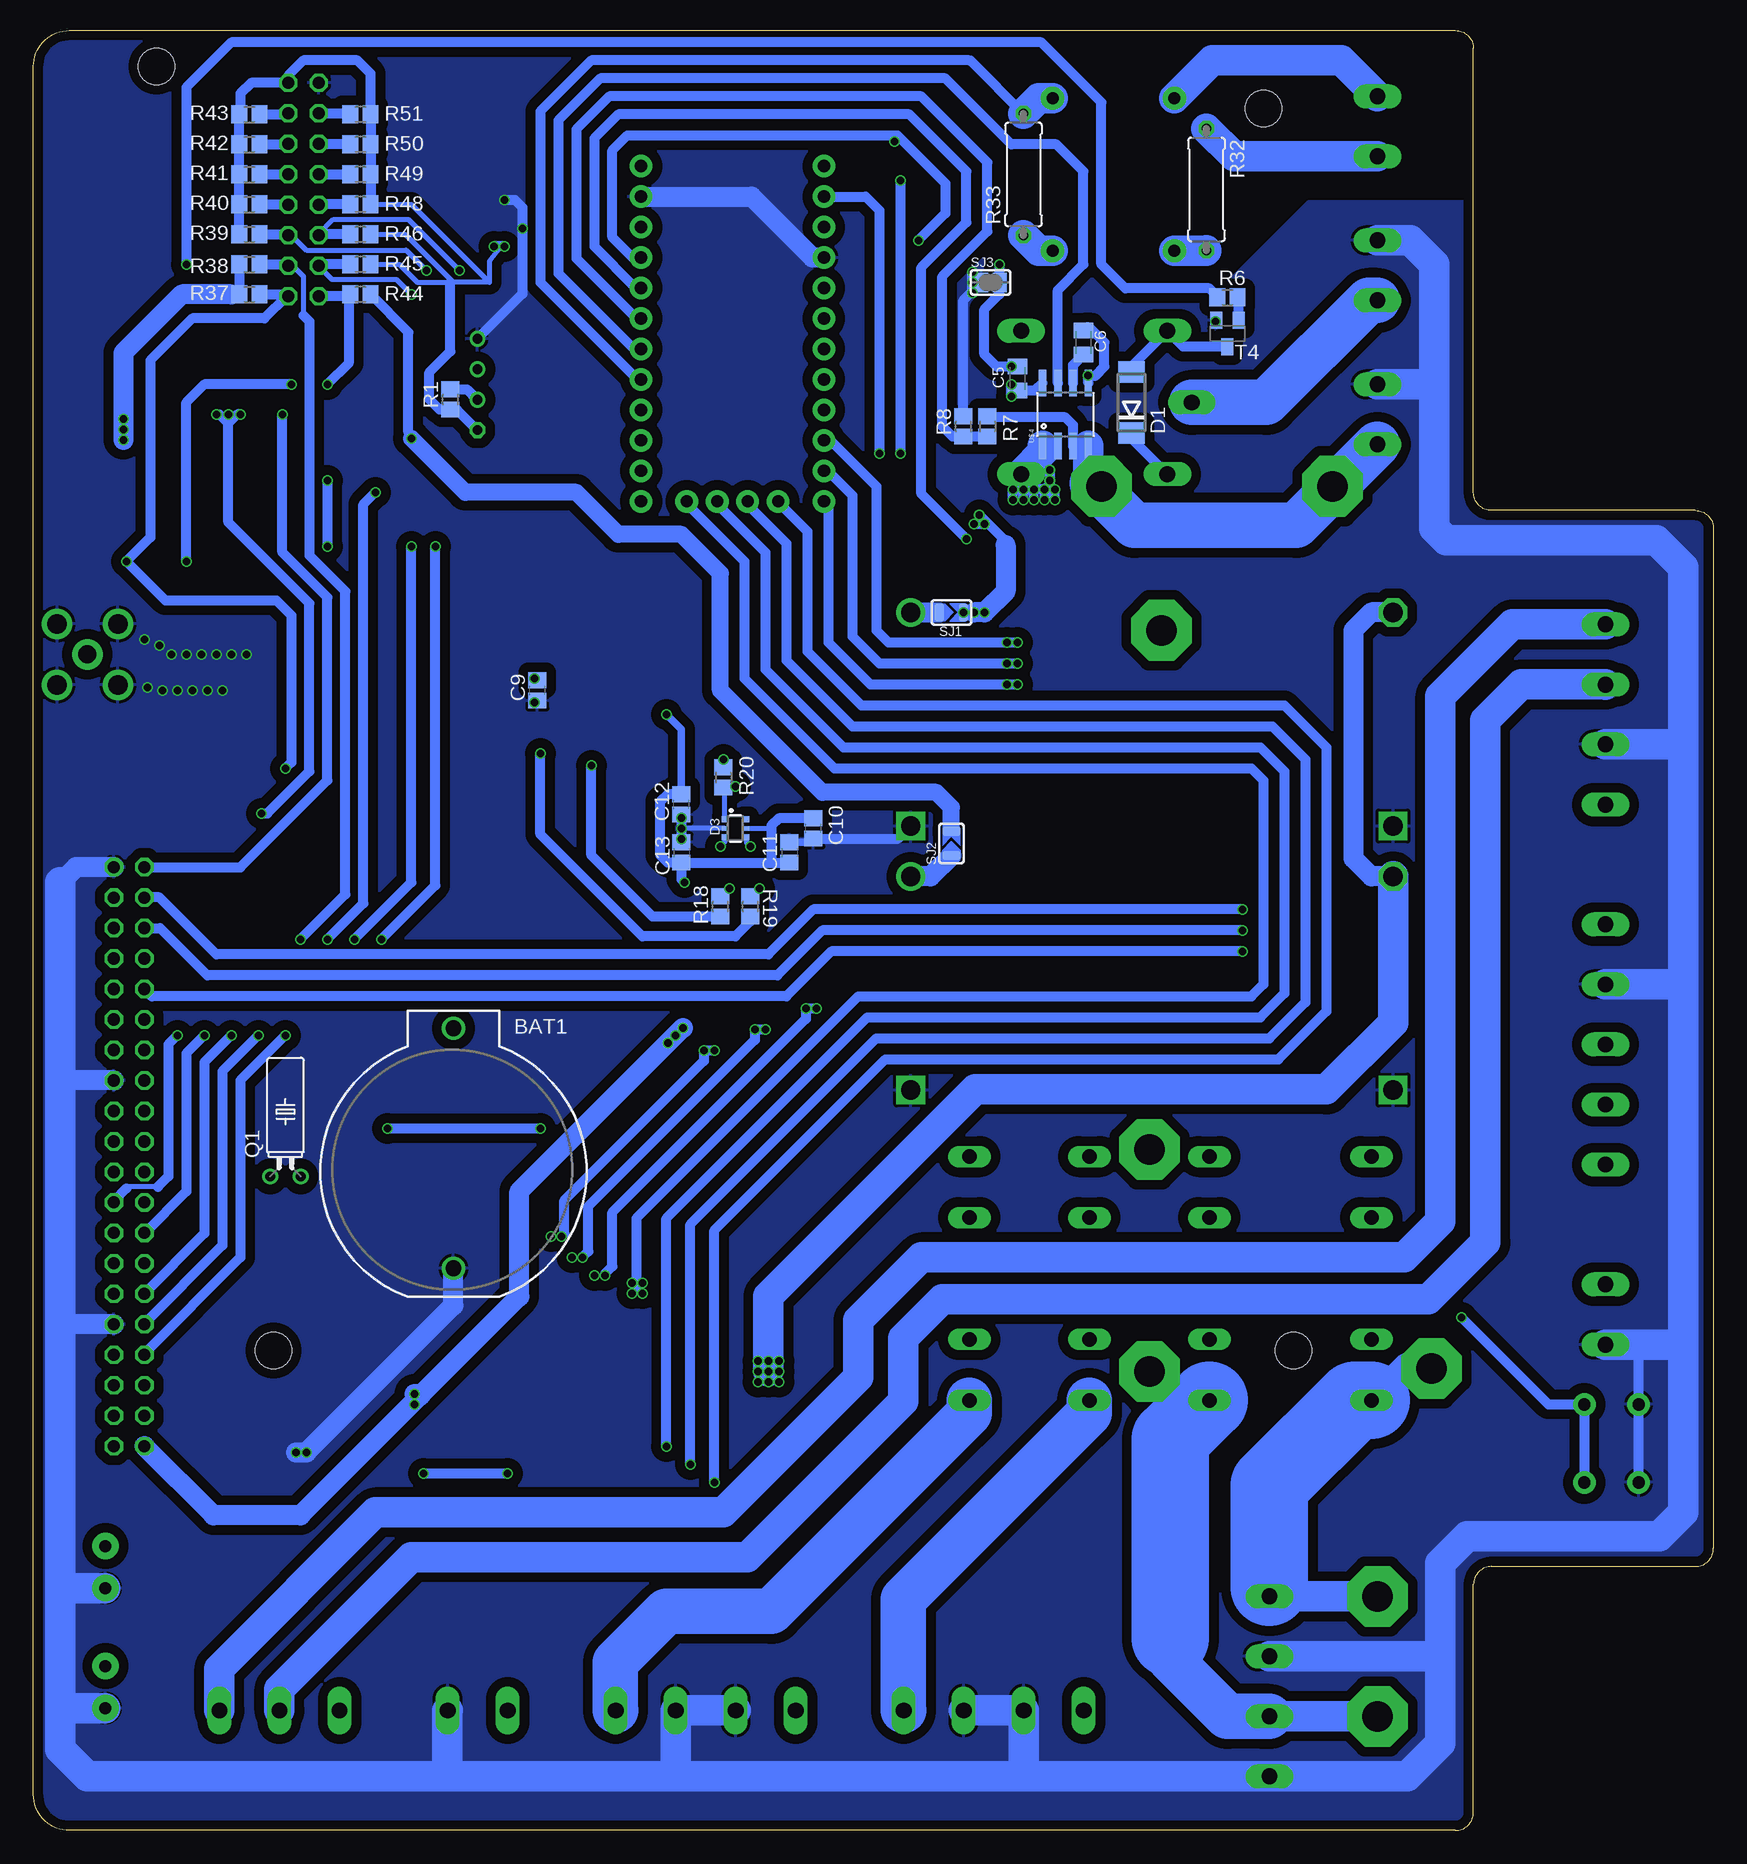
[diagram p3: board, bottom side, seen from below]

Size 140 x 150 mm. Coordinates in mm from the lower left corner, seen from the top.
Outline: 21.5,0 137,0 arc90 140,3 140,147 arc90 137,150 21.5,150 arc90 20,148.5 20,111.5 arc-90 18.5,110 1.5,110 arc90 0,108.5 0,23.5 arc90 1.5,22 18.5,22 arc-90 20,20.5 20,1.5 arc90 21.5,0
Copper layers (1*16): Top 0.035mm / dielectric 1.5mm / Bottom 0.035mm
Design rules "ITEADstudio_DRC": minimum track width 6mil, minimum drill 12mil, track to track 6mil, track to pad 6mil, pad to pad 6mil, via to via 6mil, smd to smd 0mil, copper to edge 10mil, drill to drill 10mil, minimum pad ring 10mil, minimum via ring 6mil, stop-mask expansion 2mil, vias tented up to drill 100mil, thermal gap 10mil
Holes 3 mm at 35,40 37.5,143.5 129.75,147 120,40

### Footprints (pad centres in the part's own frame; a part is rotated, then mirrored left to right if it is on the bottom)
BATTCOM_20MM_PTH = drill 1.3: 1 11.85,0; 2 -8.15,0
AK300/2 = drill 1.321 long: 1 -2.515,0; 2 2.489,0
C0805 = smd 1.3 x 1.5: 1 -0.85,0; 2 0.85,0
C0805K = smd 1.3 x 1.6: 1 -1,0; 2 1,0
153CLV-0605 = smd 3.5 x 1.6: + 2.7,0; - -2.7,0
DO214AA = smd 1.8 x 2.2: A 2.55,0; C -2.55,0
SOT363 = smd 0.5 x 0.5: 1 -0.75,-0.9; 3 0.75,-0.9; 4 0.75,0.9; 6 -0.75,0.9 | smd 0.4 x 0.5: 2 0,-0.9; 5 0,0.9
FUSE1 = drill 1.194 long: 1A -10.16,0; 1B -5.08,0; 2A 10.16,0; 2B 5.08,0
1X2-3.5MM = drill 1 pad 2.184: 1 1.8,0; 2 -1.7,0
AK300/3 = drill 1.321 long: 1 -5.004,0; 2 0,0; 3 5.004,0
SIM900_SMT = smd 2 x 0.6: P$1 -12.4,8; P$2 -12.4,7; P$3 -12.4,6; P$4 -12.4,5; P$5 -12.4,4; P$6 -12.4,3; P$7 -12.4,2; P$8 -12.4,1; P$9 -12.4,0; P$10 -12.4,-1; P$11 -12.4,-2; P$12 -12.4,-3; P$13 -12.4,-4; P$14 -12.4,-5; P$15 -12.4,-6; P$16 -12.4,-7; P$17 -12.4,-8; P$35 12.4,-8; P$36 12.4,-7; P$37 12.4,-6; P$38 12.4,-5; P$39 12.4,-4; P$40 12.4,-3; P$41 12.4,-2; P$42 12.4,-1; P$43 12.4,0; P$44 12.4,1; P$45 12.4,2; P$46 12.4,3; P$47 12.4,4; P$48 12.4,5; P$49 12.4,6; P$50 12.4,7; P$51 12.4,8 | smd 0.6 x 2: P$18 -8,-12.4; P$19 -7,-12.4; P$20 -6,-12.4; P$21 -5,-12.4; P$22 -4,-12.4; P$23 -3,-12.4; P$24 -2,-12.4; P$25 -1,-12.4; P$26 0,-12.4; P$27 1,-12.4; P$28 2,-12.4; P$29 3,-12.4; P$30 4,-12.4; P$31 5,-12.4; P$32 6,-12.4; P$33 7,-12.4; P$34 8,-12.4; P$52 8,12.4; P$53 7,12.4; P$54 6,12.4; P$55 5,12.4; P$56 4,12.4; P$57 3,12.4; P$58 2,12.4; P$59 1,12.4; P$60 0,12.4; P$61 -1,12.4; P$62 -2,12.4; P$63 -3,12.4; P$64 -4,12.4; P$65 -5,12.4; P$66 -6,12.4; P$67 -7,12.4; P$68 -8,12.4
SO16 = smd 0.66 x 2.032: 1 -4.445,-3.073; 2 -3.175,-3.073; 3 -1.905,-3.073; 4 -0.635,-3.073; 5 0.635,-3.073; 6 1.905,-3.073; 7 3.175,-3.073; 8 4.445,-3.073; 9 4.445,3.073; 10 3.175,3.073; 11 1.905,3.073; 12 0.635,3.073; 13 -0.635,3.073; 14 -1.905,3.073; 15 -3.175,3.073; 16 -4.445,3.073
MA08-2 = drill 1.016 octagon: 1 -8.89,-1.27; 2 -8.89,1.27; 3 -6.35,-1.27; 4 -6.35,1.27; 5 -3.81,-1.27; 6 -3.81,1.27; 7 -1.27,-1.27; 8 -1.27,1.27; 9 1.27,-1.27; 10 1.27,1.27; 11 3.81,-1.27; 12 3.81,1.27; 13 6.35,-1.27; 14 6.35,1.27; 15 8.89,-1.27; 16 8.89,1.27
SIMHOLDER = smd 2 x 1.2: C1 -12.61,-3.81; C2 -12.61,-1.27; C3 -12.61,1.27; C5 12.61,-3.81; C6 12.61,-1.27; C7 12.61,1.27
WIRE_HOLE-14AWG = drill 2.54 pad 5.08 octagon: P$1 0,0
G5LE = drill 1.321 long: 1 -7.493,-5.969; 2 -7.493,5.969; O 4.699,5.969; P -9.525,0; S 4.699,-5.969
L0603 = smd 1.1 x 1: 1 -0.85,0; 2 0.85,0
CHIPLED_0805 = smd 1.2 x 1.2: A 0,-1.05; C 0,1.05
AK300/5 = drill 1.321 long: 1 -10.008,0; 2 -5.004,0; 3 0,0; 4 5.004,0; 5 10.008,0
AK500/2 = drill 1.321 long: 1 -2.515,0; 2 2.515,0
RASPBERRY_PI_B+ = drill 1.016 octagon: 1 2.02,1.7; 2 2.02,4.24; 3 4.56,1.7; 4 4.56,4.24; 5 7.1,1.7; 6 7.1,4.24; 7 9.64,1.7; 8 9.64,4.24; 9 12.18,1.7; 10 12.18,4.24; 11 14.72,1.7; 12 14.72,4.24; 13 17.26,1.7; 14 17.26,4.24; 15 19.8,1.7; 16 19.8,4.24; 17 22.34,1.7; 18 22.34,4.24; 19 24.88,1.7; 20 24.88,4.24; 21 27.42,1.7; 22 27.42,4.24; 23 29.96,1.7; 24 29.96,4.24; 25 32.5,1.7; 26 32.5,4.24; 27 35.04,1.7; 28 35.04,4.24; 29 37.58,1.7; 30 37.58,4.24; 31 40.12,1.7; 32 40.12,4.24; 33 42.66,1.7; 34 42.66,4.24; 35 45.2,1.7; 36 45.2,4.24; 37 47.74,1.7; 38 47.74,4.24; 39 50.28,1.7; 40 50.28,4.24
TC38H = drill 0.813: 1 -1.27,0; 2 1.27,0
R0805 = smd 1.3 x 1.5: 1 -0.85,0; 2 0.85,0
0309/10 = drill 0.813 octagon: 1 -5.08,0; 2 5.08,0
TACTILE-PTH = drill 1.016 pad 1.88: 1 -3.251,2.261; 2 3.251,2.261; 3 -3.251,-2.261; 4 3.251,-2.261
SOLDERJUMPER_ARROW_NOPASTE = smd 0.762 x 1.524: 1 -1.016,0; 2 1.016,0
SOLDERJUMPER_CLOSEDWIRE = smd 1.168 x 1.6: 1 -0.762,0; 2 0.762,0 | smd 0.635 x 0.203: WIRE 0,0
SOT23-BEC = smd 1 x 1.4: B -0.95,-1.1; C 0,1.1; E 0.95,-1.1
TV16 = drill 1 pad 1.93: IA -5.08,-6.35; IB -5.08,6.35; OA 5.08,6.35; OB 5.08,-6.35
SOIC8_150MIL = smd 0.6 x 2.2: 1 -1.905,-2.6; 2 -0.635,-2.6; 3 0.635,-2.6; 4 1.905,-2.6; 5 1.905,2.6; 6 0.635,2.6; 7 -0.635,2.6; 8 -1.905,2.6
RHT03_DHT-22 = drill 0.8: DATA -1.27,0; GND 3.81,0; NULL 1.27,0 | drill 0.8 octagon: VDD -3.81,0
ARDUINO_PRO_MINI = drill 1.016 pad 1.88: 1 -7.62,12.7; 2 -7.62,10.16; 3 -7.62,7.62; 4 -7.62,5.08; 5 -7.62,2.54; 6 -7.62,0; 7 -7.62,-2.54; 8 -7.62,-5.08; 9 -7.62,-7.62; 10 -7.62,-10.16; 11 -7.62,-12.7; 12 -7.62,-15.24; 13 7.62,-15.24; 14 7.62,-12.7; 15 7.62,-10.16; 16 7.62,-7.62; 17 7.62,-5.08; 18 7.62,-2.54; 19 7.62,0; 20 7.62,2.54; 21 7.62,5.08; 22 7.62,7.62; 23 7.62,10.16; 24 7.62,12.7; 25 -1.27,-15.24; 26 -3.81,-15.24; 27 3.81,-15.24; 28 1.27,-15.24
SO08 = smd 0.61 x 2.21: 1 -1.905,-2.616; 2 -0.635,-2.616; 3 0.635,-2.616; 4 1.905,-2.616; 5 1.905,2.616; 6 0.635,2.616; 7 -0.635,2.616; 8 -1.905,2.616
DCDCMODULE = drill 1.6 square: GND#0 1.7,1.7; GND#1 41.9,1.7 | drill 1.6 octagon: VIN 1.7,19.5 | drill 1.6: VOUT 41.9,19.5
SMA90_DIP = drill 1.5 pad 2.54: ANTENNA 0,0 | drill 1.6 pad 2.54: GND1 -2.54,2.54; GND2 2.54,2.54; GND3 -2.54,-2.54; GND4 2.54,-2.54

### Placement (x,y rotation side)
BAT1  105,55 90 bottom
BUC_SPLY  37,7 270 top
C1  119.75,45.5 0 top
C2  62.5,138.5 0 top
C3  65,109.25 180 top
C4  65,105.25 180 top
C5  58,121 270 bottom
C6  52.5,124 270 bottom
C7  135,88.5 90 top
C8  127,88.5 90 top
C9  98,95 90 bottom
C10  75,83.5 90 bottom
C11  77,81.5 270 bottom
C12  86,85.5 90 bottom
C13  86,81.5 270 bottom
D1  48.5,119 90 bottom
D3  81.5,83.5 270 bottom
F1  62,46 90 top
F3  52,46 90 top
F4  42,46 90 top
F5  28.5,46 90 top
FAN_A  134,22 270 top
FAN_B  134,12 270 top
FROM_LTC_REG  119.5,10 0 top
IC1  108,96.5 270 top
IC2  104.5,136.5 90 top
INDICATOR_CONN  117.5,136.75 90 top
J1  81.5,91.5 90 top
J2  47,56.75 0 top
J3  46,100 0 top
J4  51,112 0 top
J5  31.75,112 0 top
J6  23.5,38.5 0 top
J7  28,19.5 0 top
J8  28,9.5 0 top
J9  47,38.25 0 top
K1  53,119 0 top
L1  122,85.5 270 top
LED1  125.25,115 180 top
LED2  130.25,115 180 top
MDM_REG_A  79,10 0 top
MDM_REG_B  89,10 0 top
MDM_SPLY_HT_X1_X3  9,65.5 270 top
MDM_SPLY_HX_A  9,98 270 top
MDM_SPLY_HX_B  9,88 270 top
PCB1  135,30 90 top
Q1  119,54.5 0 bottom
R1  105.25,119.25 90 bottom
R2  117.5,18 90 top
R3  119.5,18 270 top
R4  99,18 90 top
R5  126,77.5 0 top
R6  40.5,127.75 0 bottom
R7  60.5,117 270 bottom
R8  62.5,117 90 bottom
R9  66.5,140.75 180 top
R10  45,19.5 0 top
R11  45,17.5 180 top
R12  45,9.5 0 top
R13  45,7.5 180 top
R14  122.5,18 90 top
R15  124.5,18 270 top
R16  52.5,18 90 top
R17  54.5,18 270 top
R18  82.75,77 90 bottom
R19  80.25,77 90 bottom
R20  82.5,87.75 270 bottom
R21  126.5,105.75 180 top
R22  126.5,108 180 top
R23  127.5,115 270 top
R24  131.5,105.75 180 top
R25  131.5,108 180 top
R26  132.5,115 270 top
R27  111.5,112.5 90 top
R28  112.5,18 90 top
R29  114.5,18 270 top
R30  71.25,140.5 270 top
R31  71.25,136.5 270 top
R32  42.25,136.75 270 bottom
R33  57.5,138 90 bottom
R34  101,18 270 top
R35  126,70 0 top
R36  126,75.25 0 top
R37  122,128 0 bottom
R38  122,130.5 0 bottom
R39  122,133 0 bottom
R40  122,135.5 0 bottom
R41  122,138 0 bottom
R42  122,140.5 0 bottom
R43  122,143 0 bottom
R44  112.75,128 180 bottom
R45  112.75,130.5 180 bottom
R46  112.75,133 180 bottom
R47  70.5,128.5 0 top
R48  112.75,135.5 180 bottom
R49  112.75,138 180 bottom
R50  112.75,140.5 180 bottom
R51  112.75,143 180 bottom
R52  62.5,140.75 180 top
R53  128,56.5 90 top
RPI_RESET  8.5,32.25 270 top
SCADA_REG_A  55,10 0 top
SCADA_REG_B  65,10 0 top
SCADA_SPLY  9,43 270 top
SCPC_SPLY  37,17 270 top
SJ1  63.5,101.5 0 bottom
SJ2  63.5,82.25 90 bottom
SJ3  60.25,129 0 bottom
T1  126.5,111 0 top
T2  131.5,111 0 top
T3  114.5,112.5 270 top
T4  40.5,124.75 180 bottom
TO_LTC_REG  103,10 0 top
TV16  50,138 0 top
U1  120,49.5 270 top
U3  103,120.5 90 top
U$1  81.75,126 0 top
U$2  59,107 270 top
U$3  25,82 0 top
U$4  54,118 0 bottom
U$6  25,60 0 top
U$8  113.25,32.75 0 top
V_ACCU  28,118 270 top
V_PWR_SPLY  28,130 270 top
VAC  28,142 270 top
X1  135.5,98 270 top

### Tracks (layer width: path | path; a pad name or v marks a point on that pad's centre or on a via)
+3V3  (via drill 0.6)
  Top 0.813: R23.1 127.5,116.25 | 132.5,116.38 v132.5,115.88 R26.1 | v121,84.75 121.9,84.75 L1.2
  Top 1.422: 127.75,118 132.12,118 v132.5,117.62 v132.5,116.75 | 127.5,116.25 127.5,117.75 127.75,118 | v108.5,116 120.75,116 v122.75,118 127.75,118
  Bottom 0.813: SJ2.2 63.5,83.5 | R38.1 R37.1 123.5,128 | v121,84.75 120.5,84.75 117,88.25 117,102.25 123.75,109 123.75,117.25 | 123.75,117.25 v123.75,118 | v122.75,118 123,118 123.75,117.25 | v124.75,118 124.5,118 123.75,117.25 | v108.5,116 108.5,116.25 108.75,116.5 108.75,124.85 R44.1
  Bottom 1.422: 63.5,83.5 63.5,85.25 64.75,86.5 74.25,86.5 82.75,95 82.75,104.75 86,108 91.25,108 94.75,111.5 104,111.5 v108.5,116
  Bottom 1.676: v132.5,115.88 v132.5,116.75 132.5,123.12 127.62,128 123.5,128
+5V  (via drill 0.6)
  Top 0.813: C3.2 63.66,108.91 U$2.8 60.78,108.91 v60.75,108.88 | v61.19,109.62 61.19,109.31 v61.62,108.88 | v58.5,120.5 58.5,120 | v108.25,35.5 108.48,35.5 U$8.16 | 69,128.5 R47.1 69.65,129.1 v66.25,132.5 | U$1.21 90.08,131.08 91.06,132.06 IC2.16 100.93,132.06 v101.62,132 | v87.12,65.62 87.25,65.5 | U1.8 121.16,51.41 120.5,50.75 120.5,45.6 C1.2 121.5,45.5 | R9.1 v68.25,140.75
  Top 1.676: 64,119.75 64,125 67.5,128.5 69,128.5 | 64,119.75 C3.2 | 58.5,120 63.75,120 64,119.75 | v108.25,36.38 v108.25,35.5 | PCB1.4 PCB1.2 130.74,32 128.5,32 125.25,35.25 125.25,42.75 122.5,45.5 121.5,45.5 | v61.62,101.5 61.62,95.12 58.25,91.75 58.25,72.5 60,70.75 76.5,70.75 77.75,69.5 83.25,69.5 v85.88,66.88 v86.5,66.25 v87.12,65.62
  Bottom 0.406: R48.1 108.5,135.5 102,129 | R46.1 109,133 105,129 | R45.1 109.5,130.5 108,129 105.25,129 105,129 | 102,129 105,129 | v101.62,132 101.12,131.88 102,130.75 102,129
  Bottom 0.61: C5.2 58.5,120
  Bottom 0.813: C5.2 56.52,120 U$4.8 | 58.98,107.11 58.98,107.42 v61.19,109.62 | v61.62,108.88 v60.75,108.88 | v58.5,119.5 58.5,120 v58.5,120.5 | v62.5,101.5 SJ1.2 v61.62,101.5 | 68,141.25 90.5,141.25 91.75,140 91.75,132.75 90.08,131.08 U$1.21 | 68,141.25 64,137.25 64,134.75 v66.25,132.5 | R39.1 R40.1 R41.1 R42.1 R43.1 122.75,143.1 122.75,144.75 121.86,145.64 INDICATOR_CONN.15 118.75,145.66 118.75,146.25 117.5,147.5 113,147.5 111.9,146.4 R51.1 R50.1 R49.1 R48.1 | v100.75,132 v101.62,132 | U3.VDD 104.71,118.4 R1.1 106.15,118.4 107,119.25 107,121.5 105.25,123.25 105.25,129 | 68,141.25 68,141 v68.25,140.75
  Bottom 1.676: 58.98,107.11 58.98,103.27 v60.75,101.5 v61.62,101.5 | v85.88,66.88 99.5,53.25 99.5,44.5 107.75,36.25 | 107.75,36.25 117.75,26.25 124.99,26.25 PCB1.2 | v108.25,36.38 107.88,36.38 107.75,36.25
+6.5V
  Top 0.813: R14.1 122.5,16.75
  Top 1.676: 122.5,16.75 122.5,15.5 124.5,13.5 FROM_LTC_REG.3
  Bottom 2.54: FROM_LTC_REG.3 124.5,13.5 111.5,26.5 82.5,26.5 71.25,37.75 71.25,42.5 66,47.75 25.75,47.75 22.75,50.75 22.75,94.5 16.75,100.5 9.02,100.5 MDM_SPLY_HX_A.1
+13.5V
  Top 0.813: R28.1 112.5,16.75
  Top 1.676: 112.5,16.75 112.5,12 112.75,11.75
  Top 2.54: FROM_LTC_REG.1 112.75,11.75 103.25,21.25 103.25,33.25 94.5,42 74.25,42 64.5,32.25 20,32.25 18,34.25 18,53.25 10.75,60.5 MDM_SPLY_HT_X1_X3.4
+19.5V
  Top 0.813: R2.1 117.5,16.75
  Top 1.676: 117.5,16.75 117.5,13.75 119.5,11.75 FROM_LTC_REG.2
  Bottom 2.54: FROM_LTC_REG.2 119.5,11.75 108.5,22.75 80.5,22.75 67.5,35.75 67.5,41 64.25,44.25 23.75,44.25 19,49 19,92.5 16,95.5 9.02,95.5 MDM_SPLY_HX_A.2
AGND  (via drill 0.6)
  Top 0.813: C3.1 C4.1 66,104.25 65.25,103.5 63,103.5 61.62,104.88 U$2.5 59.66,105.09 59,105.75 59,109.5 61,111.5 61,114.5 56.75,118.75 56.75,122 | v52.12,121.25 52.25,121.25 53,122 56.75,122 | 56.75,122 v58.5,122 | R52.2 61.65,138.65 C2.1 61.5,133.25 59.5,131.25 v59.5,130.5
  Bottom 0.813: C6.1 52.25,125.25 52,125.25 50.75,124 50.75,122 51.53,121.22 52.09,121.22 | U$4.5 52.09,121.22 | 52.09,121.22 v52.12,121.25 | C5.1 v58.5,122 59.75,122 60.75,123 60.75,126.75 59.5,128 59.5,128.99 SJ3.2 59.49,130.49 v59.5,130.5
ARDU_FLASH  (via drill 0.6)
  Top 0.813: v108.5,128 107.5,127 103,127 89.37,113.37 U$1.14
  Bottom 0.406: INDICATOR_CONN.4 116.23,130.35 115.12,129.25 109.75,129.25 v108.5,128
  Bottom 0.813: 113.7,130.4 R45.2 116.13,130.5 INDICATOR_CONN.4
ARDU_RX  (via drill 0.6)
  Top 0.813: v69.5,114.75 69.5,107.75 72.25,105 72.25,99 62.25,89 62.25,75.5 63,74.75 78.5,74.75 79.75,73.5 109.5,73.5 120.5,62.5 PCB1.26
  Bottom 0.813: U$1.2 70.66,136.16 69.5,135 v69.5,114.75
ARDU_TX  (via drill 0.6)
  Top 0.813: R30.2 71.25,139.25 | 71.25,138 R31.1 71.15,137.35 71,137.5 v67.75,137.5 | v67.75,114.75 67.75,107.25 70.5,104.5 70.5,99.75 60.5,89.75 60.5,74 61.5,73 77.5,73 78.75,71.75 108.75,71.75 120.54,59.96 PCB1.24
  Top 1.676: 71.25,139.25 71.25,138
  Bottom 0.813: v67.75,137.5 v67.75,114.75
CTRL_CHARGING  (via drill 0.6)
  Top 0.813: v127.25,130.5 127.25,120.75 126.25,119.75 120.5,119.75 119.25,118.5 v119.25,118
  Bottom 0.813: R6.1 41.35,127.85 42,128.5 49,128.5 51,130.5 51,144 56,149 123.5,149 127.25,145.25 v127.25,130.5 | PCB1.40 130.73,80.25 122.75,80.25 115.5,87.5 115.5,102.75 119.25,106.5 v119.25,118
CTRL_LED0
  Top 0.406: IC2.15 103.92,133.32 106.25,131 109.75,131 110.25,130.5 110.25,125.5 114,121.75 121,121.75 124.75,125.5 124.75,137.75 119.4,143.1 INDICATOR_CONN.13
  Bottom 0.813: R43.2 118.87,143 INDICATOR_CONN.13
CTRL_LED1
  Top 0.406: IC2.1 110.44,132.06 111,131.5 111,125.75 114.25,122.5 120.75,122.5 124,125.75 124,137.25 119.5,141.75 117.58,141.75 INDICATOR_CONN.14
  Bottom 0.813: INDICATOR_CONN.14 113.7,143.1 R51.2
CTRL_LED2
  Top 0.406: IC2.2 110.67,133.32 111.75,132.25 111.75,126 114.5,123.25 120.5,123.25 123.25,126 123.25,136.75 119.44,140.56 INDICATOR_CONN.11
  Bottom 0.813: R42.2 118.83,140.5 INDICATOR_CONN.11
CTRL_LED3
  Top 0.406: IC2.3 110.66,134.59 112.5,132.75 112.5,126.25 114.75,124 120.25,124 122.5,126.25 122.5,136.25 119.5,139.25 117.54,139.25 INDICATOR_CONN.12
  Bottom 0.813: INDICATOR_CONN.12 113.66,140.56 R50.2
CTRL_LED4
  Top 0.406: IC2.4 110.64,135.87 113.25,133.25 113.25,126.5 115,124.75 120,124.75 121.75,126.5 121.75,135.75 119.48,138.02 INDICATOR_CONN.9
  Bottom 0.813: R41.2 118.79,138 INDICATOR_CONN.9
CTRL_LED5
  Top 0.406: IC2.5 110.61,137.13 114,133.75 114,126.75 115.25,125.5 119.75,125.5 121,126.75 121,135.25 119.5,136.75 117.5,136.75 INDICATOR_CONN.10
  Bottom 0.813: INDICATOR_CONN.10 113.62,138.02 R49.2
CTRL_LED6
  Top 0.406: IC2.6 110.59,138.41 114.75,134.25 114.75,127 115.5,126.25 119.5,126.25 120.25,127 120.25,134 INDICATOR_CONN.7
  Bottom 0.813: R40.2 118.79,135.5 INDICATOR_CONN.7
CTRL_LED7
  Top 0.406: IC2.7 110.58,139.68 114.77,135.48 INDICATOR_CONN.8
  Bottom 0.813: R48.2 116.21,135.5 INDICATOR_CONN.8
CTRL_LED8  (via drill 0.6)
  Top 0.813: v107.25,130 105.75,128.5 102.25,128.5 89.59,115.84 U$1.15
  Bottom 0.406: INDICATOR_CONN.5 118.5,132.94 117.25,131.69 108.94,131.69 v107.25,130
  Bottom 0.813: R39.2 118.83,133 INDICATOR_CONN.5
CTRL_LED9  (via drill 0.6)
  Top 0.813: v104.5,130 101.5,130 89.88,118.38 U$1.16
  Bottom 0.406: INDICATOR_CONN.6 116.23,133.02 115,134.25 108.75,134.25 v104.5,130
  Bottom 0.813: 113.66,132.94 R46.2 116.17,133 INDICATOR_CONN.6
CTRL_SIM_PWRKEY  (via drill 0.6)
  Top 0.406: R27.1 v111.5,111.5
  Top 0.813: v123.5,66.25 v115.5,74.25
  Bottom 0.813: PCB1.12 130.76,44.74 125.75,49.75 125.75,64 v123.5,66.25 | v115.5,74.25 112.5,77.25 112.5,110.5 v111.5,111.5
DHT_DATA
  Top 0.813: U3.DATA 97.84,119.23 U$1.13
  Bottom 0.813: R1.2 103.87,120.1 U3.DATA
GND  (via drill 0.6)
  Top 0.406: v122.25,98 v123.5,98 v124.75,98 v126,98 v127.25,98 | v127.25,98 v128.5,98 128.75,98 v129.5,98.75 130,99.25 v130.75,99.25 | v127.25,98 127.25,99.5 | v130.5,95.25 130.25,95 v129.25,95 v128,95 v126.75,95 v125.5,95 v124.25,95 123.5,94.25 | 132.88,108 R25.1
  Top 0.61: IC1.P$65 120.4,101.15 120.25,101 | IC1.P$62 IC1.P$61 119,97.5 | 111,85.75 IC1.P$46 | IC1.P$46 111,82 | IC1.P$46 IC1.P$45 | 119,90.5 IC1.P$54 IC1.P$53 | IC1.P$58 118.75,94.5 118.5,94.25 | IC1.P$58 123.25,94.5 | IC1.P$58 IC1.P$59 | 93.5,103.75 94.25,104.5 IC1.P$18 95.6,108.35 96.12,108.88 96.83,108.88 96.85,108.9 IC1.P$17 | 93.5,94.25 94.25,93.5 IC1.P$29 98.25,93.5 98.25,91.75 104,86 IC1.P$39 104,82 | 85.25,83.5 85.19,83.56
  Top 0.813: 43.5,16.75 43.5,16.85 R11.2 | 43.5,6.75 43.5,6.85 R13.2 | 55,16.75 54.9,16.75 R17.2 | 101.5,16.75 101.4,16.75 R34.2 | R15.2 125.1,17.15 125.25,17 | R3.2 119.5,15 122,12.5 122,6.75 | R29.2 114.5,14 117,11.5 117,6.75 | U$8.6 115.68,29.68 115.75,29.75 | U$8.7 116.32,29.68 116.25,29.75 | 70.5,135.5 71,135.5 71.15,135.65 R31.2 71.25,134.75 | U$1.23 92.09,136.16 94.75,133.5 v99.25,133.5 | v100.75,135.88 100.76,135.87 IC2.13 103.86,135.87 104.5,136.5 104.5,140.5 104.94,140.94 IC2.8 110.44,140.94 115.14,145.64 INDICATOR_CONN.16 | T1.E 127.45,108.1 | 127.45,108.1 R22.1 | 132.2,108.1 R25.1 132.45,108.1 T2.E | 127.45,108.1 128.15,108.1 129,107.25 129,104.25 | 132.88,108 133.5,108 134,107.5 134,104.75 133.5,104.25 129,104.25 | 129,104.25 129,103.25 126.75,101 120.25,101 | 120.25,101 119,101 118.25,101.75 118.25,109 116.25,111 114.25,111 113.7,111.55 T3.E | IC1.P$63 IC1.P$62 | 120.25,101 120.25,100.65 IC1.P$64 IC1.P$63 | X1.GND1 X1.GND3 | X1.GND2 X1.GND4 131.5,94 123.75,94 123.5,94.25 123.25,94.5 | X1.GND3 132.79,100.54 | IC1.P$63 127.25,99.5 127.5,99.5 128.5,100.5 132.92,100.5 X1.GND3 | 119,97.5 118.5,97 118.5,94.25 118.5,91 | 119,90.5 118.5,91 | 111,85.75 116.25,91 118.5,91 | C8.- 127,84 125,82 111,82 104,82 93.25,82 91.75,83.5 v86,83.5 85.25,83.5 86,82.75 v86,82.62 | 98.25,93.5 v98.25,94 | 93.5,94.25 93.5,103.75 93.14,104.11 J1.C5 | U$3.GND#1 67.3,83.7 67.5,83.5 85.12,83.5 85.19,83.56 v86,84.38 | BAT1.2 105.75,47.59 U1.4 118.9,46.09 C1.1
  Top 1.676: V_PWR_SPLY.1 28.02,132.5 34.75,132.5 v41.5,125.75 44.5,128.75 61.5,128.75 v61.75,129 | v61.75,129.88 61.76,129.75 61.76,128.26 61.38,128.63 v61.75,129 | 43.5,16.75 41.26,14.51 SCPC_SPLY.2 | BUC_SPLY.2 41.26,4.51 43.5,6.75 | SCADA_REG_A.2 57.49,14.26 55,16.75 | TO_LTC_REG.2 105.49,12.76 101.5,16.75 | 125.25,17 130.8,17 133.65,19.85 | 133.65,19.85 FAN_A.1 | 122,5.5 129.3,5.5 FAN_B.1 | 117,6.75 118.25,5.5 122,5.5 | 122,6.75 122,5.5 | 133.65,19.85 133.25,20.25 131,20.25 121.57,29.68 U$8.8 117.62,29.75 | 115.75,29.75 116.25,29.75 117.62,29.75 | 70.5,135.5 66.25,135.5 61.75,131 v61.75,129 | 117.62,29.75 117.62,31 v118.12,31.5 v117.25,31.5 | U$1.4 73.42,131.08 71.25,133.25 71.25,134.75 | C8.- C7.- 135,81.98 PCB1.39
  Top 2.54: MDM_SPLY_HX_B.1 19.89,90.52 U$3.GND#0 | MDM_SPLY_HT_X1_X3.2 17.9,70.5 U$6.GND#0 | U$6.GND#1 86.45,61.7 86.5,61.75 98,61.75 105,54.75 BAT1.2
  Bottom 0.406: v98.25,94 98.15,94 C9.1 | D3.2 v86,83.5
  Bottom 0.61: C11.1 75.3,82.35 C10.1
  Bottom 0.813: R8.2 62.5,127.51 SJ3.1 61.01,128.99 v61.75,128.12 v61.75,129.88 | T4.E 41.45,125.8 v41.5,125.75 | v100.75,135.88 99.88,135.88 99.25,135.25 v99.25,133.5 99.25,128.06 U3.GND | C12.1 v86,83.5 C13.1 | C10.1 67.95,82.65 U$3.GND#1 | 6.25,40.48 6.24,40.48 6.24,36 RPI_RESET.3 RPI_RESET.4
  Bottom 1.676: PCB1.39 136.47,80.28 137.75,79 | PCB1.9 137.57,42.18 137.75,42 | PCB1.25 137.5,62.5 137.75,62.25 | v118.12,31.5 v117.25,31.5 105,43.75 BAT1.2 | U$1.4 75.08,131.08 80.16,136.16 U$1.23
  Bottom 2.54: V_PWR_SPLY.1 25.27,132.51 23.25,130.5 23.25,120.25 | 23.25,120.25 23.25,108.5 22.25,107.5 4.75,107.5 2.5,105.25 2.5,90 | 2.5,90 2.5,70.75 | 2.5,70.75 2.5,40.5 | 2.5,40.5 2.5,26.5 4.5,24.5 20.5,24.5 22.75,22.25 22.75,14.75 | 57.25,4.51 BUC_SPLY.2 36.99,4.5 25.5,4.5 22.75,7.25 22.75,14.75 | 57.25,4.51 86.5,4.51 | 86.5,4.51 105.5,4.51 | 105.5,4.51 110.49,4.51 110.5,4.5 135.5,4.5 137.75,6.75 137.75,10.25 | 105.5,4.51 TO_LTC_REG.2 | 86.5,4.51 86.48,4.53 MDM_REG_B.1 MDM_REG_A.2 | SCADA_REG_B.1 SCADA_REG_A.2 57.49,4.75 57.25,4.51 | SCADA_SPLY.2 6.25,40.48 2.52,40.48 2.5,40.5 | MDM_SPLY_HX_B.1 3.02,90.52 2.5,90 | V_ACCU.1 23.52,120.52 23.25,120.25 | FAN_B.1 137.7,10.2 137.75,10.25 | MDM_SPLY_HT_X1_X3.2 2.75,70.5 2.5,70.75 | 137.75,20.12 137.75,42 137.75,62.25 137.75,79 | 137.75,20.12 137.75,10.25 | FAN_A.1 137.68,20.2 137.75,20.12 | SCPC_SPLY.2 22.99,14.51 22.75,14.75
  pour Bottom (isolate 0.813): 50.5,150 50.5,140.75 50.5,129.75 50.5,129 40.5,129 35.5,134 34,135.5 33.75,135.75 20,135.75 20,110 0,110 0,22 20,22 20,0 140,0 140,150
  pour Top (isolate 0.406): 140,119 109.5,119 103.5,113 103.25,112.75 94.25,112.75 93.25,111.75 93,111.5 92.75,111.25 92.75,81.5 93,81.25 125.25,81.25 125.75,81.75 140,81.75
MDM_INDC_0  (via drill 0.6)
  Top 0.813: MDM_SPLY_HX_B.2 9,82.25 14.5,76.75 v39.25,76.75 | R5.2 127,77.5 127.25,77.75 PCB1.38
  Bottom 0.813: PCB1.38 129.5,77.75 124.75,73 78.75,73 75,76.75 v39.25,76.75
MDM_INDC_1  (via drill 0.6)
  Top 0.813: MDM_SPLY_HT_X1_X3.1 9.49,75.51 11.75,73.25 v39.25,73.25 | R35.2 130.64,70 PCB1.32
  Bottom 0.813: PCB1.32 130.14,69.5 77.25,69.5 73.5,73.25 v39.25,73.25
MDM_INDC_2  (via drill 0.6)
  Top 0.813: MDM_SPLY_HT_X1_X3.3 6,65.5 5,66.5 5,77.25 6,78.25 10.5,78.25 13.75,75 v39.25,75 | R36.2 130.71,75.25 PCB1.36
  Bottom 0.813: PCB1.36 129.45,75.2 125.5,71.25 78,71.25 74.25,75 v39.25,75
N$1
  Bottom 2.54: VAC.2 39.93,139.51 R32.1
N$2
  Bottom 2.54: VAC.1 28.02,144.51 31,147.5 41.77,147.5 TV16.IB
N$3
  Top 0.813: U1.1 118.66,51.41 120.25,53 120.25,54.48 Q1.1
N$4
  Top 0.813: U1.2 115.86,50.13 115.25,50.75 115.25,52 116,52.75 117,52.75 117.75,53.5 117.75,54.48 Q1.2
N$5
  Top 0.813: U1.3 113.39,48.87 112.75,49.5 112.75,50.5
  Top 1.676: BAT1.1 105,60.75 112.75,53 112.75,50.5
N$6
  Top 0.813: U$8.13 112.61,34.12 112,33.5 110.75,33.5 110.08,34.17 U$8.15
N$7
  Top 0.813: U$8.4 112.61,31.86 113.89,33.13 U$8.12
N$8
  Bottom 1.676: U$3.VOUT SJ1.1
N$9
  Bottom 1.676: SJ2.1 63.52,81.23 65.25,79.5 U$6.VOUT
N$10
  Top 0.813: U$2.6 63.38,106.36 64,105.75 C4.2
N$11
  cutout Top: 104.62,104.88 104.62,97.12 111.38,97.12 111.38,104.88
N$12
  cutout Top: 113.88,98.62 113.88,94.38 118.12,94.38 118.12,98.62
N$13
  Bottom 0.813: T4.B 39.55,127.65 R6.2
N$14
  cutout Bottom: 20,150 49.75,150 49.75,129.75 41,129.75 34.25,136.5 20,136.5
N$16
  Bottom 0.813: U$4.6 53.37,122.14 C6.2
N$17
  Bottom 3.81: MDM_REG_B.2 91.5,14 87.25,18.25 78.5,18.25 62.62,34.12 62.25,34.5 62,34.75 F1.1A
N$19
  Bottom 3.81: SCADA_REG_B.2 67.5,19.25 52.62,34.12 52.25,34.5 52,34.75 F3.1A
N$21
  Top 0.406: 121.5,96.5 IC1.P$60
  Top 0.813: X1.ANTENNA 131.25,98 129.75,96.5 121.5,96.5
N$22
  Top 0.406: IC1.P$57 IC1.P$56 IC1.P$55
  Top 0.813: L1.1 122.1,86.35 123.5,87.75 123.5,90.95 123.75,91.2
  Top 1.676: C7.+ C8.+ 123.75,91.2 123.55,91.2 122.25,92.5 IC1.P$56
N$23  (via drill 0.6)
  Top 0.61: IC1.P$26 97.75,96.5 v98.25,96
  Bottom 0.406: v98.25,96 98.15,96 C9.2
N$24  (via drill 0.6)
  Top 0.61: IC1.P$33 94.25,89.5
  Top 0.813: 94.25,89.5 v93.5,88.75
  Bottom 0.813: R18.1 88.4,76.15 93.5,81.25 v93.5,88.75
N$25  (via drill 0.6)
  Top 0.61: IC1.P$32 97,90.5 v97.75,89.75
  Bottom 0.813: R19.1 80.25,75.75 81.5,74.5 89.25,74.5 97.75,83 v97.75,89.75
N$26  (via drill 0.6)
  Top 0.61: IC1.P$31 94.25,91.5
  Top 0.813: 94.25,91.5 84.75,91.5 v82.5,89.25
  Bottom 0.813: v82.5,89.25 R20.1
N$27
  Top 0.813: LED1.C 125.25,113.35 T1.C
N$28
  Top 0.406: LED1.A 125.25,116 127,114.25 127.4,114.25 R23.2
N$29
  Top 0.813: LED2.C 130.25,113.35 T2.C
N$30
  Top 0.813: T1.B 125.55,108.1 R22.2 R21.2
N$31
  Top 0.406: LED2.A 130.25,116 131.88,114.38 132.28,114.38 R26.2
N$32
  Top 0.813: R24.2 R25.2 130.55,108.1 T2.B
N$33
  Top 0.813: T3.B 111.6,113.45 R27.2
N$34
  Bottom 0.813: D1.A 48.5,121.98 K1.2 44.19,123.65 T4.C
N$35
  Top 0.813: U$1.1 74.13,140.62 73.5,141.25 71.35,141.25 R30.1
N$36
  Bottom 2.54: TV16.IA 42.27,131.65 R32.2
N$38
  Top 0.813: R9.2 R52.1 | R52.1 63.35,138.65 C2.2 | R52.1 63.35,141.9 62.75,142.5 60.5,142.5 59.75,141.75 59.75,135.17 R33.1
  Bottom 2.54: TV16.OB 56.23,131.65 R33.1
RPI_3V3  (via drill 0.6)
  Top 0.406: 129.62,53.62 132.12,53.62 132.25,53.5
  Top 0.813: R5.1 R36.1 R35.1 125.12,69.97 125.12,69.12 v128,66.25 | R53.1 128,55.25 129.62,53.62 | 132.25,53.5 133.3,52.45 PCB1.17
  Bottom 0.406: 129.62,53.62 132.12,53.62 132.25,53.5
  Bottom 0.813: 129.62,53.62 128.75,54.5 128.75,65.5 v128,66.25 | 132.25,53.5 133.3,52.45 PCB1.17
RPI_FLASH  (via drill 0.6)
  Top 0.813: v125.75,66.25 v117.75,74.25
  Bottom 0.406: INDICATOR_CONN.3 118.4,130.4 117.5,129.5 117.5,126.25
  Bottom 0.813: PCB1.16 130.7,49.8 127.25,53.25 127.25,64.75 v125.75,66.25 | v117.75,74.25 114,78 114,103.25 117,106.25 117,125.75 117.5,126.25 | R38.2 118.87,130.5 INDICATOR_CONN.3
RPI_RESET  (via drill 0.6)
  Top 0.813: R53.2 126.85,58.5 v110.5,58.5 | v97.75,58.5 70.25,58.5 69,57.25 69,47.25 67.75,46 24.25,46 v21,42.75
  Top 1.27: PCB1.22 128.07,57.42 R53.2
  Bottom 0.813: v110.5,58.5 v97.75,58.5 | v21,42.75 13.75,35.5 RPI_RESET.1 RPI_RESET.2
RTC_SCL
  Top 0.406: 132,38.38 129.5,38.38
  Top 0.813: PCB1.5 133.28,37.1 132,38.38 | 129.5,38.38 129,38.88 129,45.25 125.39,48.87 U1.6
RTC_SDA
  Top 0.406: 132.06,35.81 129.62,35.81
  Top 0.813: PCB1.3 133.3,34.58 132.06,35.81 | 129.62,35.81 128.69,35.81 127.25,37.25 127.25,44.5 124.16,47.59 U1.5
SEL_SENSOR_1  (via drill 0.6)
  Top 0.813: v75.62,68.5 56.75,68.5 56,69.25 56,94.25 57.25,95.5 v58.88,95.5 | v92.38,46.25 v93.25,46.25 96.5,46.25 103,39.75 112.75,39.75 115.16,37.34 U$8.11
  Bottom 0.813: v92.38,46.25 92.38,46.38 91.75,47 91.75,51.5 75.62,67.62 v75.62,68.5 v74.75,68.5 | U$1.12 74.01,110.76 73.75,110.5 73.75,99 70.25,95.5 v58.88,95.5 v58,95.5
SEL_SENSOR_2  (via drill 0.6)
  Top 0.813: v79.88,66.75 55.5,66.75 54.25,68 54.25,95.25 56.25,97.25 v58.88,97.25 | v94.25,47.75 v95.12,47.75 97.25,47.75 103.75,41.25 113.25,41.25 116.42,38.08 U$8.10
  Bottom 0.813: v94.25,47.75 93.75,48.25 93.75,52 79.88,65.88 v79.88,66.75 v79,66.75 | U$1.11 73.8,113.3 71.75,111.25 71.75,99.5 69.5,97.25 v58.88,97.25 v58,97.25
SEL_SENSOR_3  (via drill 0.6)
  Top 0.813: U$8.9 117.69,38.8 113.75,42.75 104.5,42.75 97.75,49.5 v96.88,49.5 v96,49.5 | v84.12,65 53.75,65 52.5,66.25 52.5,96.25 55.25,99 v58.88,99
  Bottom 0.813: v96,49.5 95.75,49.75 95.75,52.5 84.12,64.12 v84.12,65 v83.25,65 | U$1.10 73.59,115.84 69.75,112 69.75,100 68.75,99 v58.88,99 v58,99
SENSOR_BUC  (via drill 0.6)
  Top 0.813: R13.1 R12.2 45.85,9.6 47.75,11.5 47.75,19.25 49.25,20.75 70.25,20.75 80,30.5 v85.25,30.5
  Bottom 0.813: v85.25,30.5 85.25,50.5 69.75,66 37,66 34,69 34,89.25 36.75,92 71.75,92 77.25,97.5 77.25,107.25 80.48,110.48 U$1.25
SENSOR_IBAT
  Bottom 0.813: U$4.7 54.63,128.37 52.5,130.5 52.5,138.25 54.75,140.5 58.5,140.5 64,146 92.75,146 96.25,142.5 96.25,129.75 94.75,128.25 94.38,127.88 89.96,123.46 U$1.18
SENSOR_ILOAD  (via drill 0.6)
  Top 0.813: U$2.7 62.24,107.64 v62.25,107.62
  Bottom 0.813: v62.25,107.62 66,111.38 66,130.25 62.25,134 62.25,138.25 67,143 91.25,143 93.25,141 93.25,132 89.79,128.54 U$1.20
SENSOR_MDM  (via drill 0.6)
  Top 0.813: U$8.14 111.34,37.41 110.5,38.25 102.25,38.25 95.75,44.75 v89.25,44.75 v90.12,45.62 | v90.12,44.75 v89.25,45.62
  Bottom 0.813: 89.75,45.25 v89.25,44.75 | 89.75,45.25 89.75,45.12 v90.12,44.75 | v90.12,45.62 v89.25,45.62 | 89.75,45.25 89.75,51 71.25,69.5 38.5,69.5 37.5,70.5 37.5,87.5 38.5,88.5 73.25,88.5 80.75,96 80.75,105.75 85.56,110.56 U$1.27
SENSOR_MDM_0
  Top 0.813: R15.1 R14.2 113.89,27.46 U$8.5
SENSOR_MDM_1
  Top 0.813: R29.1 R28.2 110.08,21.27 U$8.2
SENSOR_MDM_2
  Top 0.813: R3.1 R2.2 111.34,25 U$8.3
SENSOR_MDM_3  (via drill 0.6)
  Top 0.813: R4.2 100.5,18.85 | 100.5,18.85 R34.1 | U$8.1 107.57,29.68 v107.5,29.75 | v100.5,29.75 100,29.25 100,19.35 100.5,18.85
  Bottom 0.813: v107.5,29.75 v100.5,29.75
SENSOR_SCADA  (via drill 0.6)
  Top 0.813: R16.2 R17.1 70.85,18.85 81,29 v83.25,29
  Bottom 0.813: v83.25,29 83.25,50 69,64.25 36.25,64.25 32.25,68.25 32.25,90.25 35.75,93.75 71,93.75 75.5,98.25 75.5,108.25 77.94,110.69 U$1.26
SENSOR_SCPC  (via drill 0.6)
  Top 0.813: R11.1 R10.2 45.85,19.6 48.5,22.25 69.25,22.25 79,32 v87.25,32
  Bottom 0.813: v87.25,32 87.25,51 70.5,67.75 37.75,67.75 35.75,69.75 35.75,88.25 37.75,90.25 72.5,90.25 79,96.75 79,106.5 83.02,110.52 U$1.28
SENSOR_VAC
  Bottom 0.813: U$1.17 89.67,120.92 97.75,129 97.75,143.25 93.5,147.5 62,147.5 arc45 61.86,147.44 R33.2
  Bottom 2.54: TV16.OA 56.23,144.35 R33.2
SENSOR_VBAT
  Bottom 0.813: R7.2 R8.1 63.4,116.15 64.25,117 64.25,129.5 60.5,133.25 60.5,139 66,144.5 92,144.5 94.75,141.75 94.75,131 93.25,129.5 93,129.25 89.75,126 U$1.19
SIM_NETLIGHT  (via drill 0.6)
  Top 0.406: R24.1 v132.25,105.75
  Top 0.61: v119,88.5 IC1.P$52
  Bottom 0.813: v119,88.5 118.5,89 118.5,101.25 119.75,102.5 129,102.5 v132.25,105.75 130.25,107.75 130.25,122.5 126.75,126 120.75,126 118.91,127.84 118.91,128 | R37.2 118.91,128 | 118.91,128 INDICATOR_CONN.1
SIM_PWRKEY  (via drill 0.6)
  Top 0.61: IC1.P$1 116,107.5 v115.5,107 | T3.C v115.5,112.5
  Bottom 0.813: v115.5,112.5 v115.5,107
SIM_RX  (via drill 0.6)
  Top 0.61: IC1.P$10 107,107.5 v106.5,107
  Top 0.813: v119,66.25 v111,74.25
  Bottom 0.813: PCB1.8 130.76,39.74 122.75,47.75 122.75,62.5 v119,66.25 | v111,74.25 106.5,78.75 v106.5,107
SIM_STATUS  (via drill 0.6)
  Top 0.406: IC1.P$66 121.25,102.5 | R21.1 v127.25,105.75
  Top 0.813: 121.25,102.5 126,102.5 127.35,103.85 R21.1 | v115.5,120.5 v118.5,120.5
  Bottom 0.813: 113.74,127.86 R44.2 | 113.74,127.86 113.74,122.26 v115.5,120.5 | v118.5,120.5 125.75,120.5 127.25,119 v127.25,105.75 | 113.74,127.86 INDICATOR_CONN.2
SIM_TX  (via drill 0.6)
  Top 0.61: IC1.P$9 108,107.5 v108.5,107
  Top 0.813: v121.25,66.25 v113.25,74.25
  Bottom 0.813: PCB1.10 130.76,42.24 124.25,48.75 124.25,63.25 v121.25,66.25 | v113.25,74.25 108.5,79 v108.5,107
SR_DS
  Top 0.813: U$1.8 74.92,120.92 80.75,126.75 80.75,139.75 81.75,140.75 90.25,140.75 91.5,139.5 91.5,138.75 95.25,135 99.75,135 100.16,134.59 IC2.14
SR_RST
  Top 0.813: 72,128.5 R47.2 | U$1.5 75.04,128.54 76.25,129.75 76.25,141.25 80.25,145.25 92.5,145.25 96,141.75 96,140.25 96.58,139.68 IC2.10
  Top 1.676: U$1.5 72.04,128.54 72,128.5
SR_SHCP
  Top 0.813: U$1.6 75,126 77.75,128.75 77.75,140.75 80.75,143.75 91.75,143.75 94.5,141 94.5,139.75 95.84,138.41 IC2.11
SR_STCP
  Top 0.813: U$1.7 74.96,123.46 79.25,127.75 79.25,140.25 81.25,142.25 91,142.25 93,140.25 93,139.25 95.11,137.13 IC2.12
USIM_CLK  (via drill 0.6)
  Top 0.406: v80.25,82 80.25,78.91 J1.C3 79.89,78.89 v79.5,78.5
  Bottom 0.406: D3.4 80.6,82.35 v80.25,82 | v79.5,78.5 79.6,78.5 R19.2
USIM_DATA  (via drill 0.6)
  Top 0.813: J1.C7 80.23,103.98 79.75,103.5 79.75,88.75 v81.5,87
  Bottom 0.406: 82.4,87.05 R20.2 82.4,86.8 D3.1
  Bottom 0.813: 82.4,87.05 81.55,87.05 v81.5,87
USIM_RST  (via drill 0.6)
  Top 0.406: v82.75,82 82.75,78.91 J1.C2 82.39,78.89 v82,78.5
  Bottom 0.406: D3.3 82.4,82.35 v82.75,82 | v82,78.5 82.1,78.5 R18.2
USIM_VDD  (via drill 0.6)
  Top 0.61: IC1.P$30 93.75,92.5 93.25,93 v87.25,93
  Top 0.813: v85.75,79 85.42,79 J1.C1
  Bottom 0.406: D3.5 78.5,83.5
  Bottom 0.61: v87.25,93 86,91.75 C12.2
  Bottom 0.813: C12.2 87.15,86.35 87.75,85.75 87.75,81.25 87.15,80.65 C13.2 | C13.2 78.5,80.65 | 78.5,80.65 C11.2 | C10.2 77.9,84.35 78.5,83.75 78.5,83.5 78.5,80.65 | C13.2 86,79.25 v85.75,79
VBAT
  Bottom 0.406: J5.P$1 32.25,112 32.25,111.25 | J4.P$1 51.62,112 51.62,112.12
  Bottom 0.61: U$4.3 U$4.4
  Bottom 0.813: U$4.3 53.37,117.11 54,117.75 60.4,117.75 R7.1
  Bottom 2.54: U$4.4 52.09,112.59 51.75,112.25
  Bottom 3.81: V_ACCU.2 32.25,111.25 34.75,108.75 48.25,108.75 51.62,112.12 51.75,112.25
VBUC
  Top 0.813: R12.1 43.75,9.5
  Top 1.676: 43.75,9.5 37.02,9.5 BUC_SPLY.1
  Bottom 2.54: J8.P$1 37.48,9.5 37.5,9.52 | F4.1A 43.59,35.84 J9.P$1
  Bottom 3.81: BUC_SPLY.1 37.5,9.52 40.52,9.52 45.25,14.25 45.25,16
  Bottom 6.452: 45.25,16 45.25,32.59 F4.1A
VLOAD
  Top 0.406: J2.P$1 46,55.75 | J3.P$1 46.25,100 46.25,99
  Top 0.61: U$2.3 U$2.4
  Top 10: 29,52.75 62.25,52.75 | 46.25,99.5 46.25,99 46.25,55.75 46,55.5 46,55.75 46,55.91 45.75,56.16
  Top 2.54: U$2.4 54.59,105.09 54.5,105
  Top 3.81: 54.5,105 51.75,105
  Top 6.452: 29,52.75 F5.2A F4.2A 45.75,56.16 F3.2A F1.2A | 51.75,105 46.25,99.5
VMDM  (via drill 0.6)
  Top 0.813: R4.1 98.65,17.15 98.5,17 | v77.88,39.12 v78.75,39.12 v78.75,38.25 v78.75,37.38 | v79.62,39.12 v79.62,38.25 v79.62,37.38 | v77.88,37.38 v77.88,38.25
  Top 1.676: 98.5,17 96.5,17 96.25,17.25
  Top 2.54: 76.48,10.02 MDM_REG_A.1 76.48,7.01 77.75,5.75 99.25,5.75 100.5,7 100.5,9.98 TO_LTC_REG.1 96.25,14.23 96.25,17.25 96.25,34.25 92.25,38.25 v79.62,38.25 v78.75,38.25 v77.88,38.25 76,38.25 66.25,28.5 18,28.5 14.25,32.25 14.25,50.25 MDM_SPLY_HT_X1_X3.5
  Bottom 1.676: U$3.VIN 28.5,101.5 30,100 30,81 28.5,79.5 U$6.VIN
  Bottom 2.54: U$6.VIN 26.7,67.3 32.25,61.75 61.5,61.75 78.75,44.5 v78.75,38.25
VPWR_SPLY
  Bottom 3.81: V_PWR_SPLY.2 28.74,127.51 37.25,119 K1.P
VSCADA
  Top 0.813: R16.1 52.5,16.75
  Top 1.676: 52.5,16.75 52.5,10.02 SCADA_REG_A.1
  Top 2.54: SCADA_SPLY.1 8.98,45.5 2.5,45.5 2.25,45.25 | 137.75,13.75 137.75,4.75 135.25,2.25 71.75,2.25 | 137.75,13.75 137.7,13.7 FAN_B.2 | 71.75,2.25 55.25,2.25 52.5,5 52.5,9.98 SCADA_REG_A.1 | FAN_A.2 135.3,23.7 137.75,21.25 137.75,13.75 | K1.1 45.51,113.01 39.75,107.25 4.25,107.25 2.25,105.25 2.25,45.25 | 2.25,45.25 2.25,26.5 4,24.75 68,24.75 77.75,34.5 89.25,34.5 92,31.75 92,16.5 90,14.5 73,14.5 72,13.5 72,2.5 71.75,2.25
  Bottom 0.813: D1.C 48.5,116.02 K1.1
VSCPC
  Top 0.813: 43.5,19.5 R10.1
  Top 1.676: SCPC_SPLY.1 43.48,19.52 43.5,19.5
  Bottom 2.54: 37,20.25 SCPC_SPLY.1 28.02,19.52 J7.P$1 | F5.1A 28.16,35.84 25.5,38.5 J6.P$1
  Bottom 6.452: F5.1A 29.91,35.84 37,28.75 37,20.25
VSPLY  (via drill 0.6)
  Top 0.406: U$2.1 U$2.2
  Top 0.813: v55.75,110.88 55.75,111 56.62,111.88
  Top 1.676: 56.25,108.5 56.25,108.77 U$2.1
  Top 2.54: K1.S 57.7,112.95 56.62,111.88 56,111.25 56,108.75 56.25,108.5
  Bottom 0.61: U$4.2 U$4.1
  Bottom 0.813: v55.31,113.38 v55.31,112.5 55.31,112.19 v55.75,111.75 | v55.75,111.75 v56.62,111.75 | v57.5,111.75 v56.62,111.75 | v57.5,111.75 v58.38,111.75 v58.38,110.88 | v55.75,111.75 v54.88,111.75 v54.88,110.88 | v55.75,111.75 v55.75,110.88 | v56.62,110.88 v56.62,111.75 | v57.5,110.88 v57.5,111.75
  Bottom 2.54: K1.S 57.7,113.05 55.75,115 55.75,115.23 U$4.1

### Text on the board
tNames: J5 | J4 | J3 | J2 | J6 | J9 | J7 | J8